# EAGLE schematic toro10 (EAGLE 7.7.0)

## Sheet 1 of 14: Power1
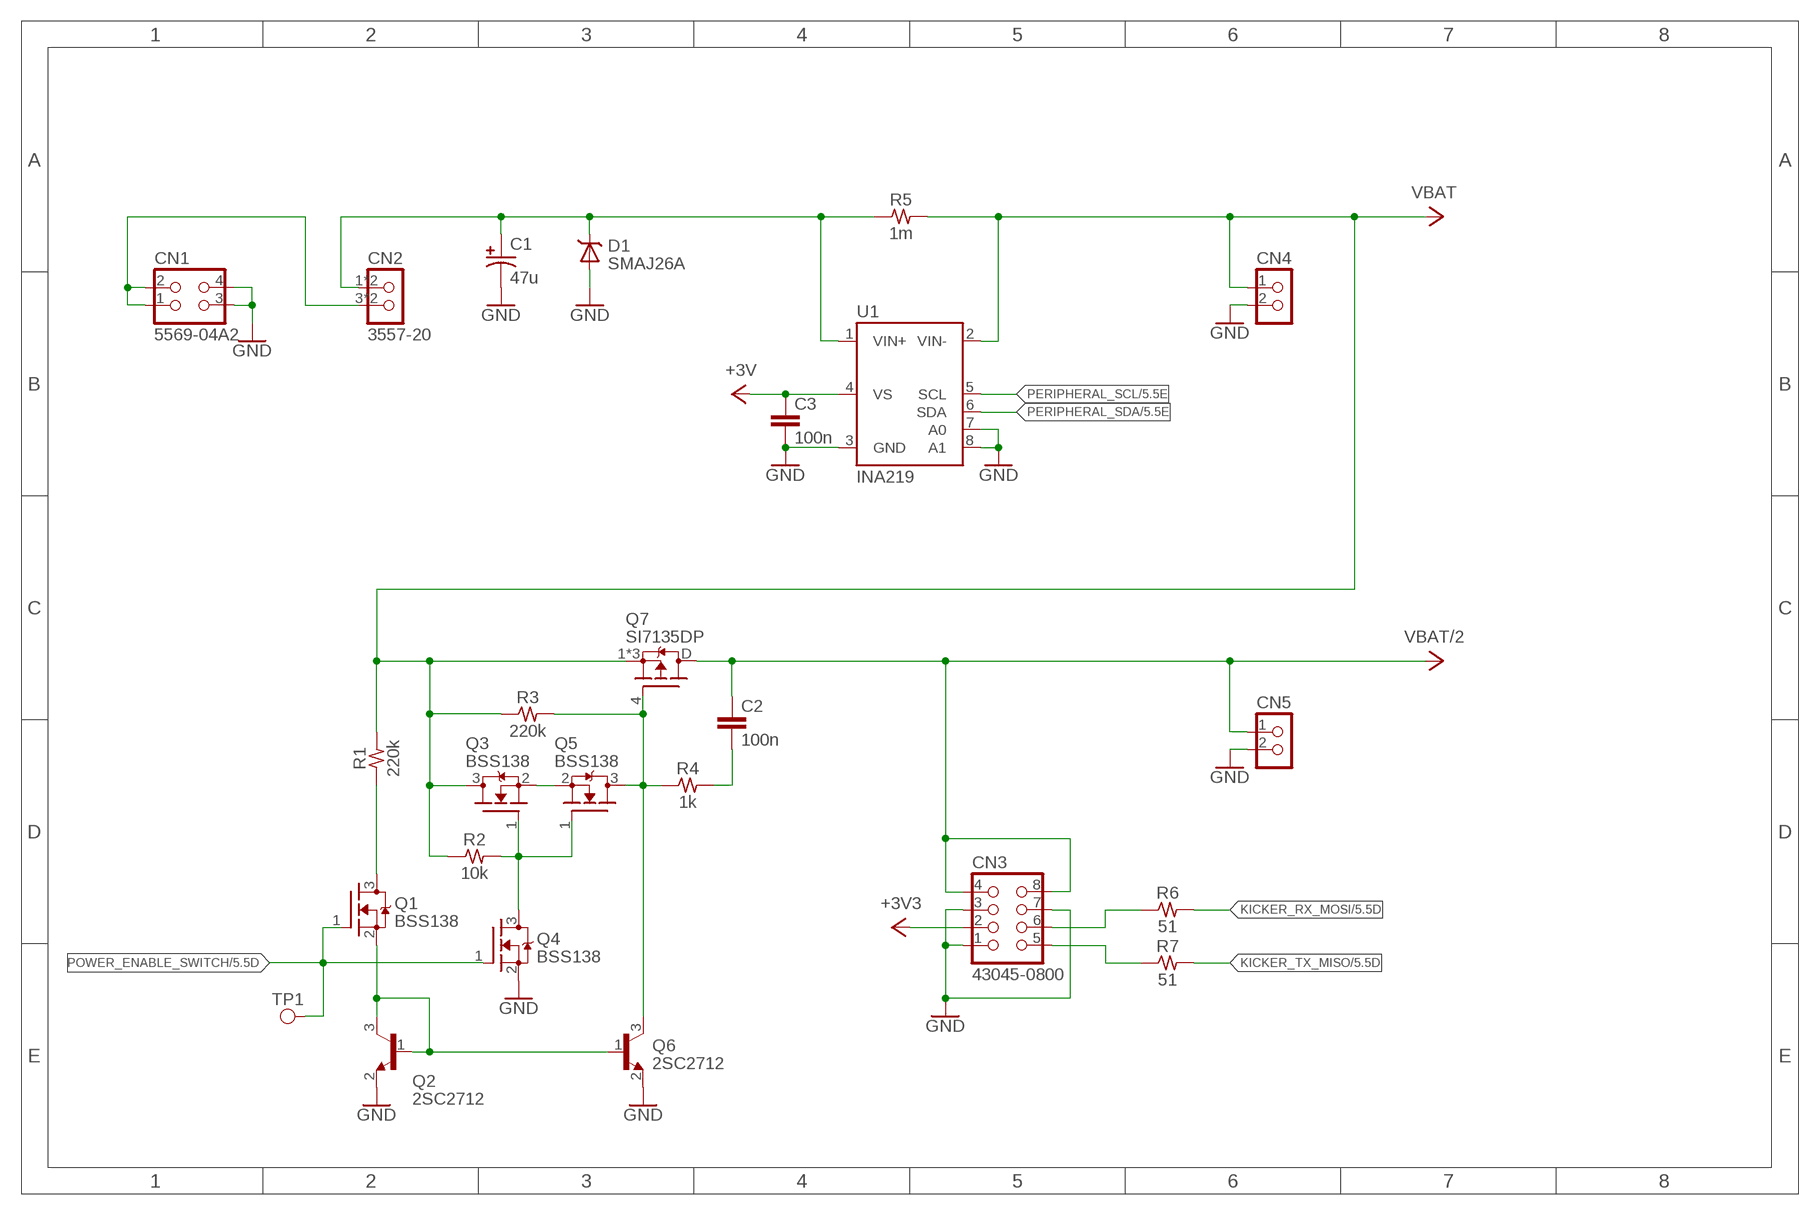
[diagram p0: schematic, sheet 1]

### Parts
C1  47u  CPOL2-5  [E2-5]
C2  100n  C1608  [1608]
C3  100n  C1608  [1608]
CN1  5569-04A2  [5569-04A2]
CN2  3557-20  [3557]
CN3  43045-0800  [43045-0800]
CN4  PIN1X2  [PIN1X2]
CN5  PIN1X2  [PIN1X2]
D1  SMAJ26A  ZENER-DO-214AC  [DO-214AC]
Q1  BSS138  MOS-N-SOT23  [SOT23-3]
Q2  2SC2712  NPN-SOT23  [SOT23-3]
Q3  BSS138  MOS-N-SOT23  [SOT23-3]
Q4  BSS138  MOS-N-SOT23  [SOT23-3]
Q5  BSS138  MOS-N-SOT23  [SOT23-3]
Q6  2SC2712  NPN-SOT23  [SOT23-3]
Q7  SI7135DP  MOS-P-POWERPAK-SO-8  [POWERPAK-SO-8-S]
R1  220k  R1608  [1608]
R2  10k  R1608  [1608]
R3  220k  R1608  [1608]
R4  1k  R1608  [1608]
R5  1m  WSLF2512  [WSLF2512]
R6  51  R1608  [1608]
R7  51  R1608  [1608]
TP1  TESTPAD-SMT  [TESTPAD-SMT]
U1  INA219  [SOT23-8]

### Nets
+3V: C3.1 U1.4(VS) ; also sheet 2,4,5,6,7,8,14
+3V3: CN3.2 ; also sheet 2,4
GND: C1.N C3.2 CN1.3 CN1.4 CN3.1 CN3.3 CN3.7 CN4.2 CN5.2 D1.A Q2.2(E) Q4.2(S) Q6.2(E) U1.3(GND) U1.7(A0) U1.8(A1) ; also sheet 2,3,4,5,6,7,8,9,10,11,12,13,14
KICKER_RX_MOSI: R6.2 ; also sheet 5
KICKER_TX_MISO: R7.2 ; also sheet 5
N$2: CN1.1 CN1.2 CN2.3 CN2.4
N$3: Q3.2(S) Q5.2(S)
N$5: Q3.1(G) Q4.3(D) Q5.1(G) R2.2
N$6: Q1.2(S) Q2.1(B) Q2.3(C) Q6.1(B)
N$9: Q5.3(D) Q6.3(C) Q7.4(G) R3.2 R4.1
N$10: C2.2 R4.2
N$11: Q1.3(D) R1.1
N$12: C1.P CN2.1 CN2.2 D1.K R5.1 U1.1(VIN+)
N$35: CN3.6 R6.1
N$36: CN3.5 R7.1
PERIPHERAL_SCL: U1.5(SCL) ; also sheet 5,6
PERIPHERAL_SDA: U1.6(SDA) ; also sheet 5,6
POWER_ENABLE_SWITCH: Q1.1(G) Q4.1(G) TP1.1 ; also sheet 5
VBAT: CN4.1 Q3.3(D) Q7.1(S) Q7.2(S) Q7.3(S) R1.2 R2.1 R3.1 R5.2 U1.2(VIN-) ; also sheet 2,4
VBAT/2: C2.1 CN3.4 CN3.8 CN5.1 Q7.D ; also sheet 3

## Sheet 2 of 14: Power2
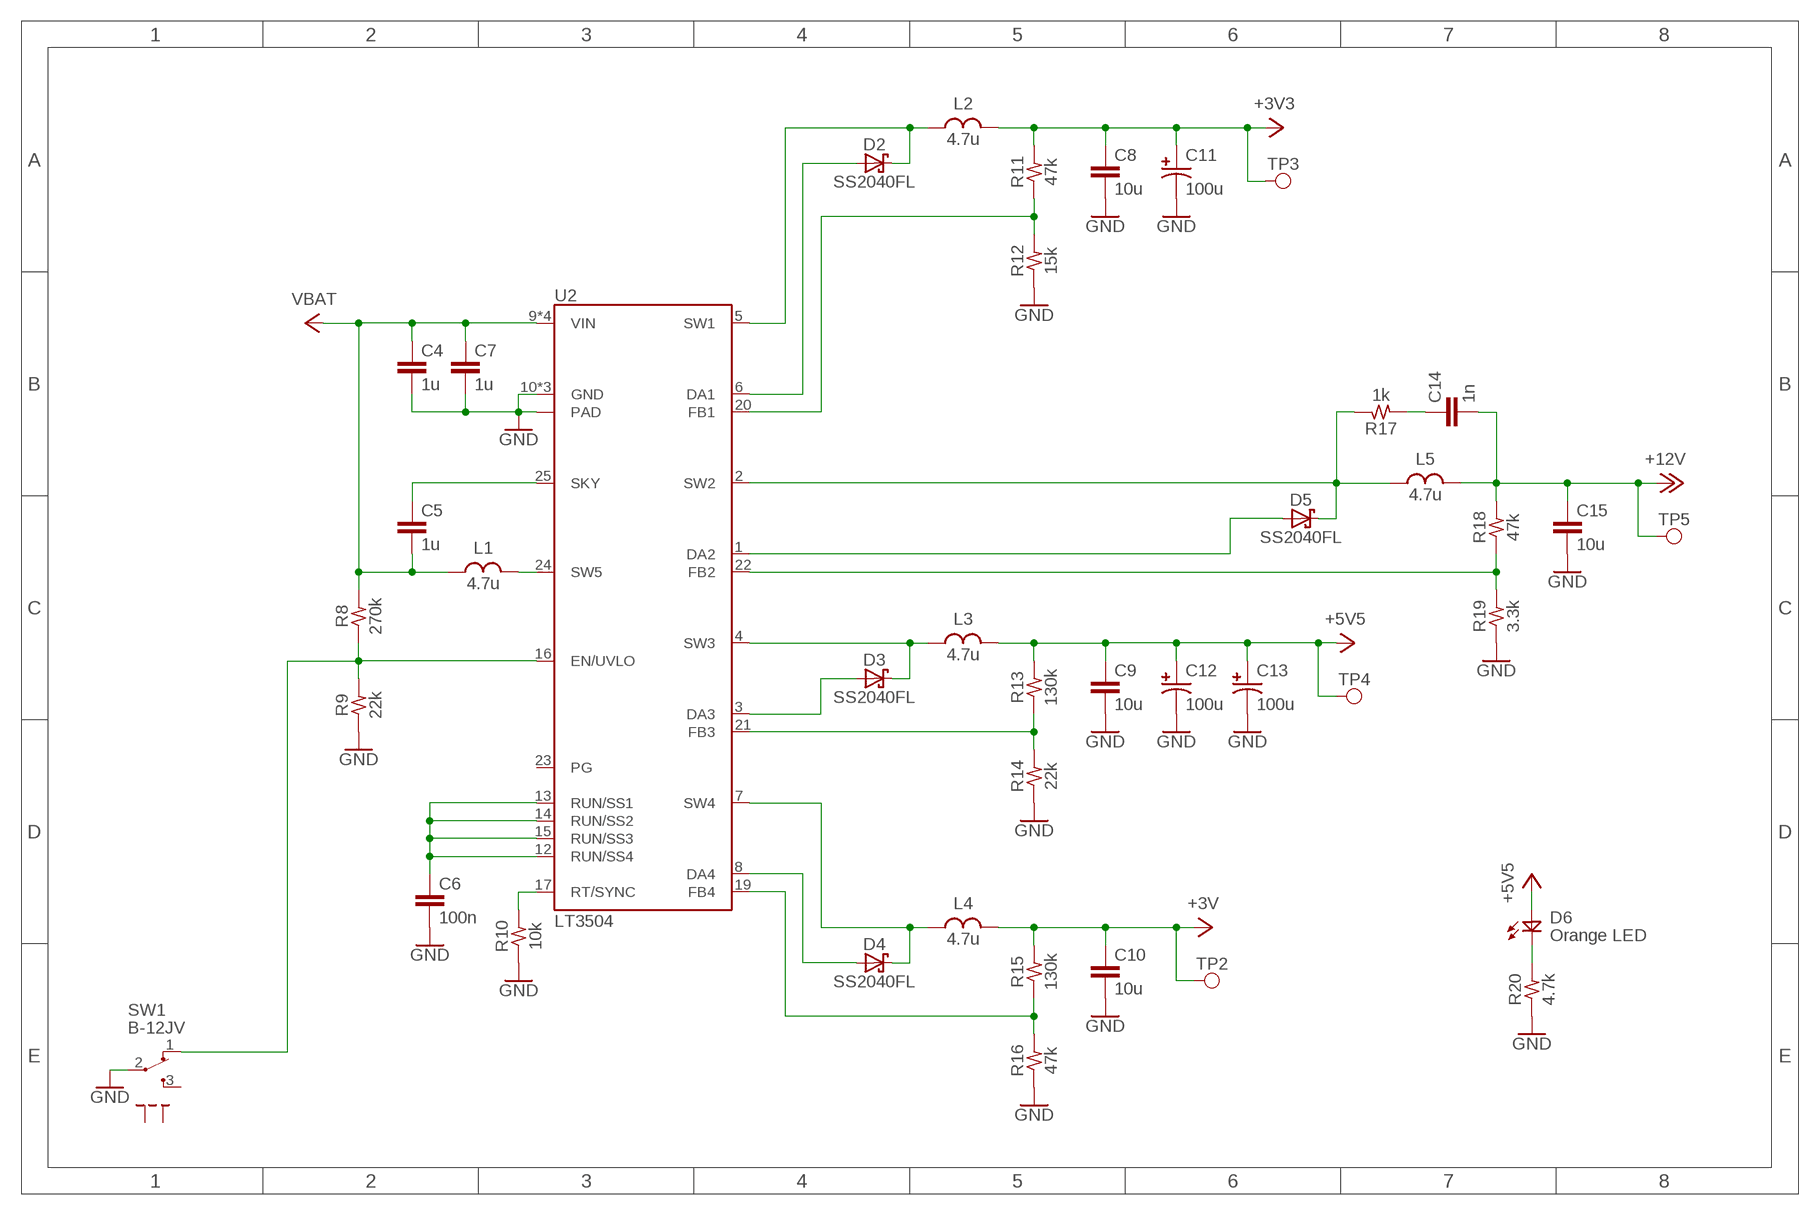
[diagram p1: schematic, sheet 2]

### Parts
C4  1u  C1608  [1608]
C5  1u  C1608  [1608]
C6  100n  C1608  [1608]
C7  1u  C1608  [1608]
C8  10u  C2012  [2012]
C9  10u  C2012  [2012]
C10  10u  C2012  [2012]
C11  100u  CPOL2-5  [E2-5]
C12  100u  CPOL2-5  [E2-5]
C13  100u  CPOL2-5  [E2-5]
C14  1n  C1608  [1608]
C15  10u  C2012  [2012]
D2  SS2040FL  SBD-SOD123  [SOD123]
D3  SS2040FL  SBD-SOD123  [SOD123]
D4  SS2040FL  SBD-SOD123  [SOD123]
D5  SS2040FL  SBD-SOD123  [SOD123]
D6  Orange LED  LED1608  [1608D]
L1  4.7u  L-TAIYO-MAMK2520  [MAMK2520]
L2  4.7u  L-TAIYO-MAMK2520  [MAMK2520]
L3  4.7u  L-TAIYO-MAMK2520  [MAMK2520]
L4  4.7u  L-TAIYO-MAMK2520  [MAMK2520]
L5  4.7u  L-TAIYO-MAMK2520  [MAMK2520]
R8  270k  R1608  [1608]
R9  22k  R1608  [1608]
R10  10k  R1608  [1608]
R11  47k  R1608  [1608]
R12  15k  R1608  [1608]
R13  130k  R1608  [1608]
R14  22k  R1608  [1608]
R15  130k  R1608  [1608]
R16  47k  R1608  [1608]
R17  1k  R1608  [1608]
R18  47k  R1608  [1608]
R19  3.3k  R1608  [1608]
R20  4.7k  R1608  [1608]
SW1  B-12JV  [B-12JV]
TP2  TESTPAD-TH  [TESTPAD-TH]
TP3  TESTPAD-TH  [TESTPAD-TH]
TP4  TESTPAD-TH  [TESTPAD-TH]
TP5  TESTPAD-TH  [TESTPAD-TH]
U2  LT3504  [QFN28-0.5]

### Nets
+3V: C10.1 L4.2 R15.2 TP2.1 ; also sheet 1,4,5,6,7,8,14
+3V3: C8.1 C11.P L2.2 R11.2 TP3.1 ; also sheet 1,4
+5V5: C9.1 C12.P C13.P D6.A L3.2 R13.2 TP4.1 ; also sheet 4,7,9,10,11,12,13
+12V: C14.2 C15.1 L5.2 R18.2 TP5.1 ; also sheet 3,9,10,11,12,13
GND: C4.2 C6.2 C7.2 C8.2 C9.2 C10.2 C11.N C12.N C13.N C15.2 R9.1 R10.1 R12.1 R14.1 R16.1 R19.1 R20.1 SW1.2(COM) U2.10(GND) U2.18(GND) U2.27(GND) U2.PAD ; also sheet 1,3,4,5,6,7,8,9,10,11,12,13,14
N$1: R18.1 R19.2 U2.22(FB2)
N$4: L1.2 U2.24(SW5)
N$7: C6.1 U2.12(RUN/SS4) U2.13(RUN/SS1) U2.14(RUN/SS2) U2.15(RUN/SS3)
N$8: R10.2 U2.17(RT/SYNC)
N$13: C5.1 U2.25(SKY)
N$14: D2.K L2.1 U2.5(SW1)
N$15: D5.K L5.1 R17.1 U2.2(SW2)
N$16: R8.1 R9.2 SW1.1(A) U2.16(EN/UVLO)
N$17: R15.1 R16.2 U2.19(FB4)
N$18: R11.1 R12.2 U2.20(FB1)
N$20: D5.A U2.1(DA2)
N$21: R13.1 R14.2 U2.21(FB3)
N$22: D3.A U2.3(DA3)
N$23: D3.K L3.1 U2.4(SW3)
N$24: D4.K L4.1 U2.7(SW4)
N$25: D4.A U2.8(DA4)
N$26: C14.1 R17.2
N$44: D2.A U2.6(DA1)
N$175: D6.K R20.2
VBAT: C4.1 C5.2 C7.1 L1.1 R8.2 U2.9(VIN) U2.11(VIN) U2.26(VIN) U2.28(VIN) ; also sheet 1,4
Unconnected: SW1.3(B) SW1.S1 SW1.S2 U2.23(PG)

## Sheet 3 of 14: Power3
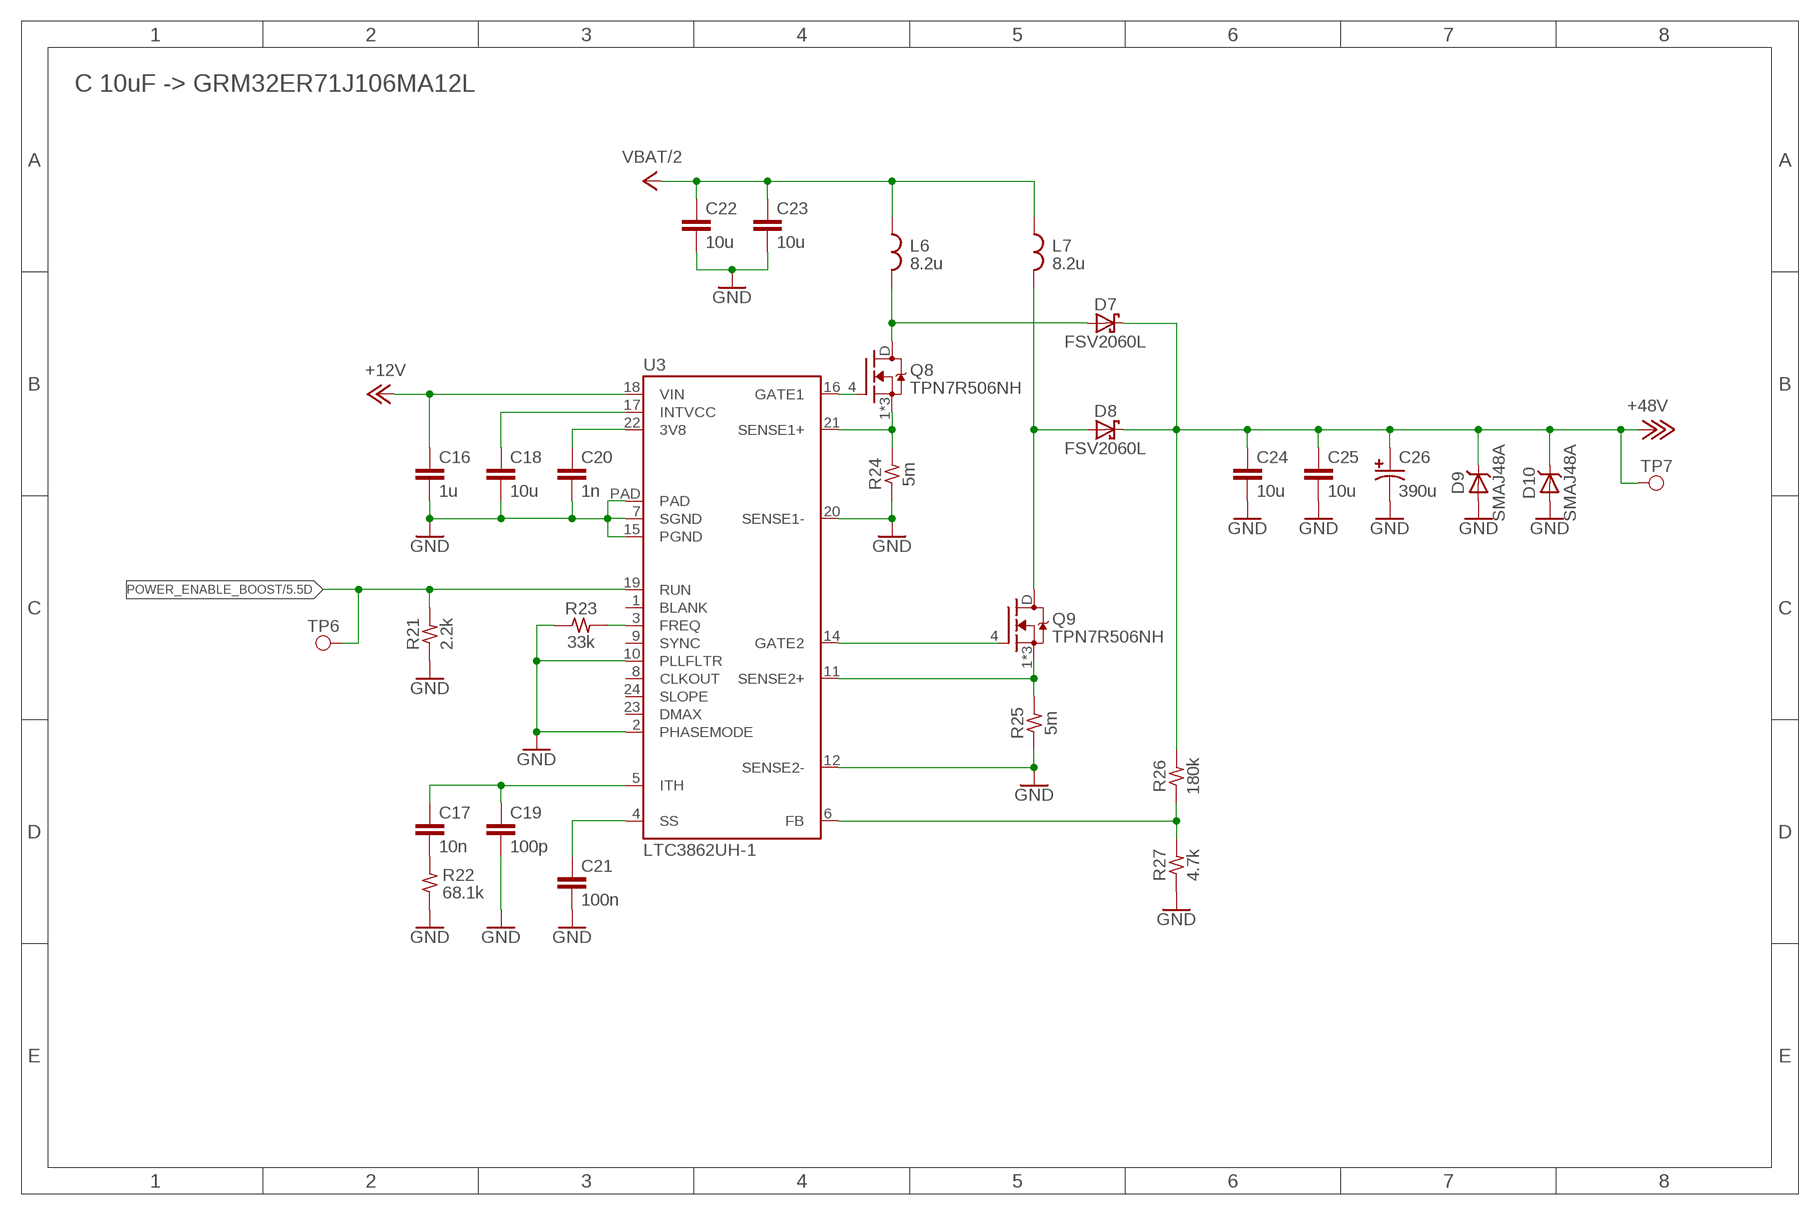
[diagram p2: schematic, sheet 3]

### Parts
C16  1u  C1608  [1608]
C17  10n  C1608  [1608]
C18  10u  C2012  [2012]
C19  100p  C1608  [1608]
C20  1n  C1608  [1608]
C21  100n  C1608  [1608]
C22  10u  C3225  [3225]
C23  10u  C3225  [3225]
C24  10u  C3225  [3225]
C25  10u  C3225  [3225]
C26  390u  CPOL7.5-18  [E7.5-18]
D7  FSV2060L  SBD-TO-277-3  [TO-277-3]
D8  FSV2060L  SBD-TO-277-3  [TO-277-3]
D9  SMAJ48A  ZENER-DO-214AC  [DO-214AC]
D10  SMAJ48A  ZENER-DO-214AC  [DO-214AC]
L6  8.2u  L-VISHAY-ER  [L-VISHAY-ER]
L7  8.2u  L-VISHAY-ER  [L-VISHAY-ER]
Q8  TPN7R506NH  MOS-N-TSON-8_3.3  [TSON-8_3.3]
Q9  TPN7R506NH  MOS-N-TSON-8_3.3  [TSON-8_3.3]
R21  2.2k  R1608  [1608]
R22  68.1k  R1608  [1608]
R23  33k  R1608  [1608]
R24  5m  R3216WL  [3216WL]
R25  5m  R3216WL  [3216WL]
R26  180k  R1608  [1608]
R27  4.7k  R1608  [1608]
TP6  TESTPAD-SMT  [TESTPAD-SMT]
TP7  TESTPAD-SMT  [TESTPAD-SMT]
U3  LTC3862UH-1  [QFN24-0.65]

### Nets
+12V: C16.1 U3.18(VIN) ; also sheet 2,9,10,11,12,13
+48V: C24.1 C25.1 C26.P D7.3(K) D8.3(K) D9.K D10.K R26.2 TP7.1 ; also sheet 9,10,11,12,13
GND: C16.2 C18.2 C19.2 C20.2 C21.2 C22.2 C23.2 C24.2 C25.2 C26.N D9.A D10.A R21.1 R22.1 R23.1 R24.1 R25.1 R27.1 U3.2(PHASEMODE) U3.7(SGND) U3.10(PLLFLTR) U3.12(SENSE2-) U3.15(PGND) U3.20(SENSE1-) U3.PAD ; also sheet 1,2,4,5,6,7,8,9,10,11,12,13,14
N$19: Q8.1(S) Q8.2(S) Q8.3(S) R24.2 U3.21(SENSE1+)
N$27: C18.1 U3.17(INTVCC)
N$29: Q8.4(G) U3.16(GATE1)
N$30: D7.1(A) D7.2(A) L6.2 Q8.D
N$31: Q9.1(S) Q9.2(S) Q9.3(S) R25.2 U3.11(SENSE2+)
N$32: C20.1 U3.22(3V8)
N$33: Q9.4(G) U3.14(GATE2)
N$34: D8.1(A) D8.2(A) L7.2 Q9.D
N$37: R26.1 R27.2 U3.6(FB)
N$39: C21.1 U3.4(SS)
N$40: C17.2 R22.2
N$41: C17.1 C19.1 U3.5(ITH)
N$42: R23.2 U3.3(FREQ)
POWER_ENABLE_BOOST: R21.2 TP6.1 U3.19(RUN) ; also sheet 5
VBAT/2: C22.1 C23.1 L6.1 L7.1 ; also sheet 1
Unconnected: U3.1(BLANK) U3.8(CLKOUT) U3.9(SYNC) U3.23(DMAX) U3.24(SLOPE)

### Notes on the sheet
- C 10uF -> GRM32ER71J106MA12L

## Sheet 4 of 14: Interface
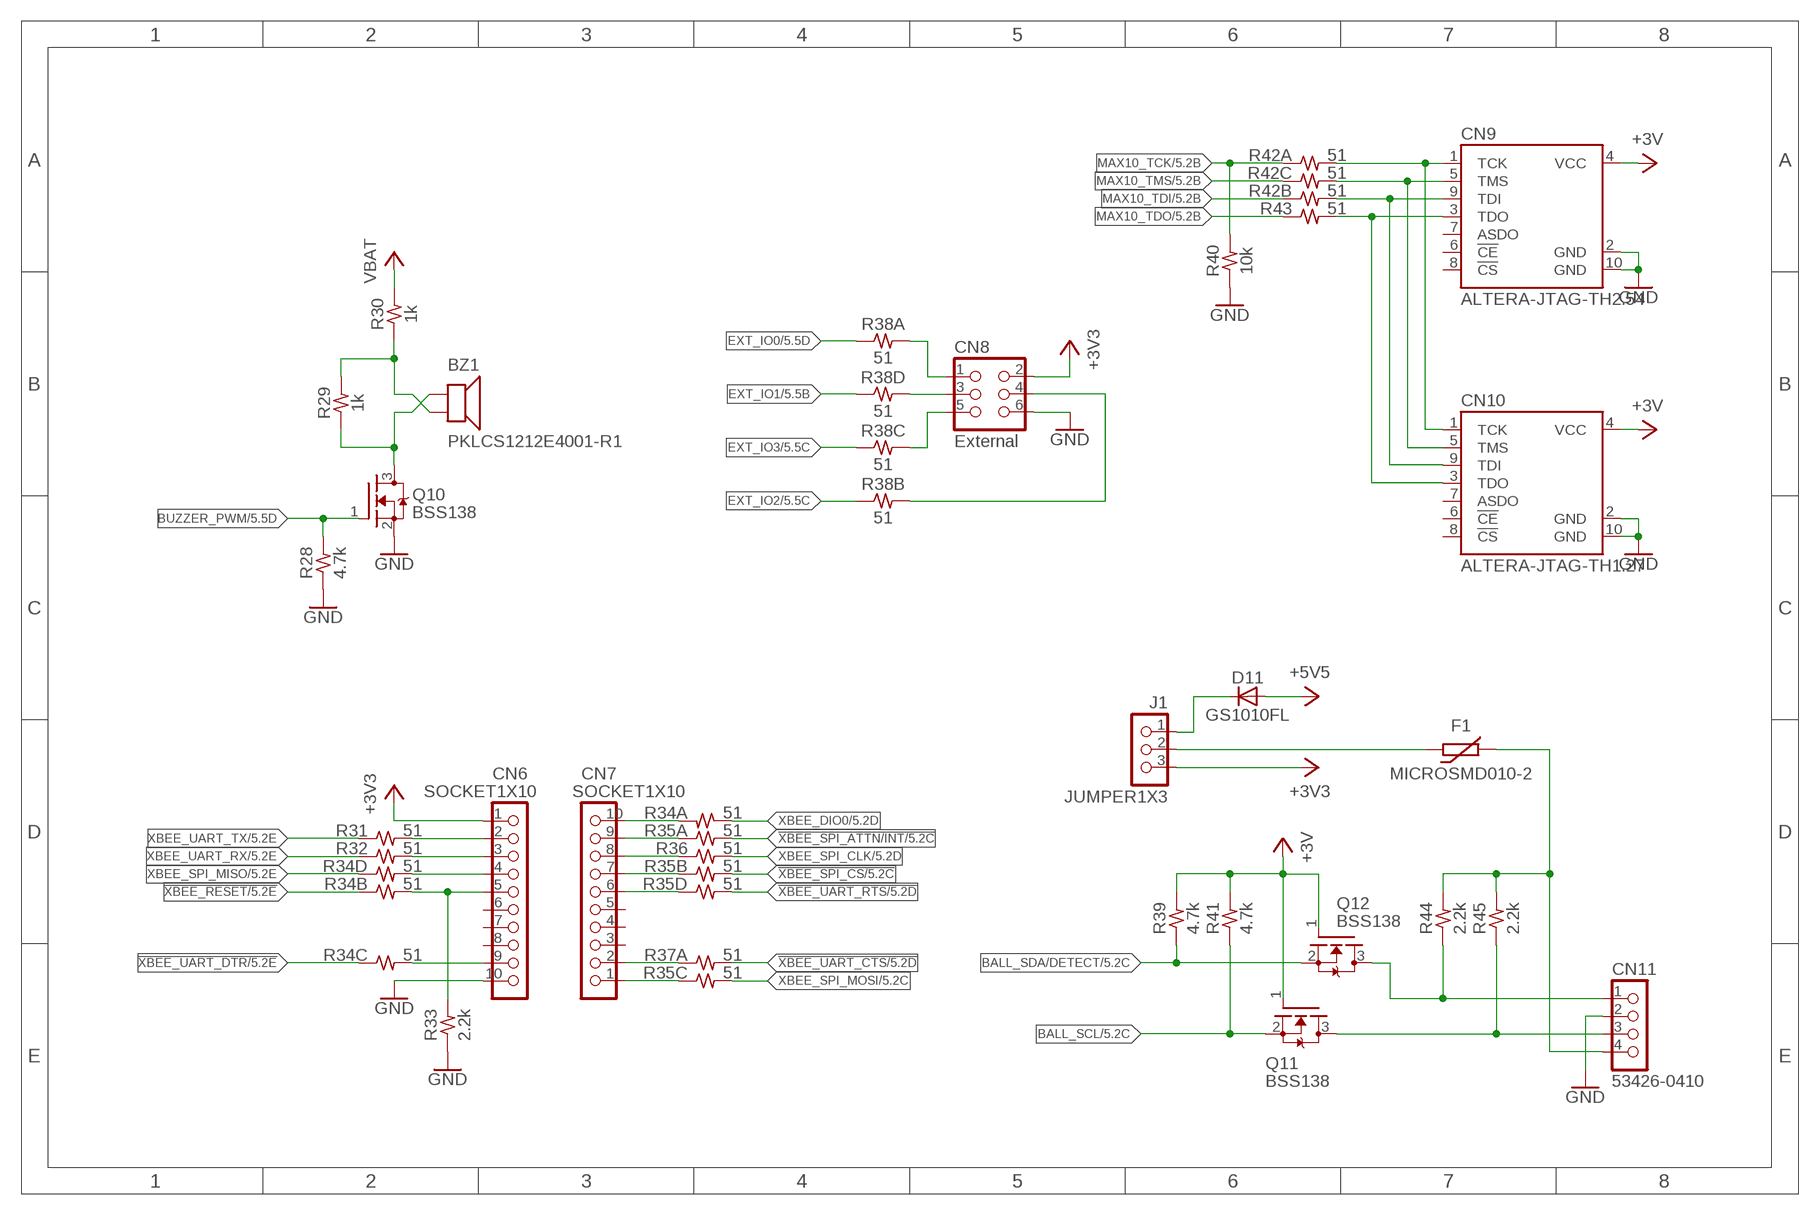
[diagram p3: schematic, sheet 4]

### Parts
BZ1  PKLCS1212E4001-R1  PKLCS1212E4001  [PKLCS1212]
CN6  SOCKET1X10  SOCKET1X10-TH2.0  [SOCKET1X10-TH2.0]
CN7  SOCKET1X10  SOCKET1X10-TH2.0  [SOCKET1X10-TH2.0]
CN8  External  PIN2X3  [PIN2X3]
CN9  ALTERA-JTAG-TH2.54  [PIN2X5]
CN10  ALTERA-JTAG-TH1.27  [PIN2X5-1.27]
CN11  53426-0410  [53426-04]
D11  GS1010FL  DIODE-SOD123  [SOD123]
F1  MICROSMD010-2  RF3225  [3225]
J1  JUMPER1X3  [PIN1X3]
Q10  BSS138  MOS-N-SOT23  [SOT23-3]
Q11  BSS138  MOS-N-SOT23  [SOT23-3]
Q12  BSS138  MOS-N-SOT23  [SOT23-3]
R28  4.7k  R1608  [1608]
R29  1k  R1608  [1608]
R30  1k  R1608  [1608]
R31  51  R1608  [1608]
R32  51  R1608  [1608]
R33  2.2k  R1608  [1608]
R34  51  R4A1608  [1608-4A]
R35  51  R4A1608  [1608-4A]
R36  51  R1608  [1608]
R37  51  R4A1608  [1608-4A]
R38  51  R4A1608  [1608-4A]
R39  4.7k  R1608  [1608]
R40  10k  R1608  [1608]
R41  4.7k  R1608  [1608]
R42  51  R4A1608  [1608-4A]
R43  51  R1608  [1608]
R44  2.2k  R1608  [1608]
R45  2.2k  R1608  [1608]

### Nets
!XBEE_RESET: R34.B1 ; also sheet 5
!XBEE_SPI_ATTN/INT: R35.A2 ; also sheet 5
!XBEE_SPI_CS: R35.B2 ; also sheet 5
!XBEE_UART_CTS: R37.A2 ; also sheet 5
!XBEE_UART_DTR: R34.C1 ; also sheet 5
!XBEE_UART_RTS: R35.D2 ; also sheet 5
+3V: CN9.4(VCC) CN10.4(VCC) Q11.1(G) Q12.1(G) R39.2 R41.2 ; also sheet 1,2,5,6,7,8,14
+3V3: CN6.1 CN8.2 J1.3 ; also sheet 1,2
+5V5: D11.A ; also sheet 2,7,9,10,11,12,13
BALL_SCL: Q11.2(S) R41.1 ; also sheet 5
BALL_SDA/DETECT: Q12.2(S) R39.1 ; also sheet 5
BUZZER_PWM: Q10.1(G) R28.2 ; also sheet 5
EXT_IO0: R38.A1 ; also sheet 5
EXT_IO1: R38.D1 ; also sheet 5
EXT_IO2: R38.B1 ; also sheet 5
EXT_IO3: R38.C1 ; also sheet 5
GND: CN6.10 CN8.6 CN9.2(GND) CN9.10(GND) CN10.2(GND) CN10.10(GND) CN11.2 Q10.2(S) R28.1 R33.1 R40.1 ; also sheet 1,2,3,5,6,7,8,9,10,11,12,13,14
MAX10_TCK: R40.2 R42.A1 ; also sheet 5
MAX10_TDI: R42.B1 ; also sheet 5
MAX10_TDO: R43.1 ; also sheet 5
MAX10_TMS: R42.C1 ; also sheet 5
N$28: CN9.5(TMS) CN10.5(TMS) R42.C2
N$38: CN9.9(TDI) CN10.9(TDI) R42.B2
N$43: CN9.1(TCK) CN10.1(TCK) R42.A2
N$138: BZ1.1 Q10.3(D) R29.1
N$139: CN9.3(TDO) CN10.3(TDO) R43.2
N$141: CN8.1 R38.A2
N$142: BZ1.2 R29.2 R30.1
N$143: CN8.3 R38.D2
N$144: CN8.5 R38.C2
N$145: CN8.4 R38.B2
N$150: CN11.4 F1.2 R44.2 R45.2
N$152: D11.K J1.1
N$155: F1.1 J1.2
N$171: CN11.3 Q11.3(D) R45.1
N$172: CN11.1 Q12.3(D) R44.1
N$180: CN7.2 R37.A1
N$181: CN7.9 R35.A1
N$182: CN7.7 R35.B1
N$183: CN7.6 R35.D1
N$184: CN7.1 R35.C1
N$185: CN7.10 R34.A2
N$186: CN6.4 R34.D2
N$187: CN6.5 R33.2 R34.B2
N$188: CN6.9 R34.C2
N$189: CN7.8 R36.1
N$190: CN6.2 R31.2
N$191: CN6.3 R32.2
VBAT: R30.2 ; also sheet 1,2
XBEE_DIO0: R34.A1 ; also sheet 5
XBEE_SPI_CLK: R36.2 ; also sheet 5
XBEE_SPI_MISO: R34.D1 ; also sheet 5
XBEE_SPI_MOSI: R35.C2 ; also sheet 5
XBEE_UART_RX: R32.1 ; also sheet 5
XBEE_UART_TX: R31.1 ; also sheet 5
Unconnected: CN6.6 CN6.7 CN6.8 CN7.3 CN7.4 CN7.5 CN9.6(!CE) CN9.7(ASDO) CN9.8(!CS) CN10.6(!CE) CN10.7(ASDO) CN10.8(!CS) R42.D1 R42.D2

## Sheet 5 of 14: FPGA
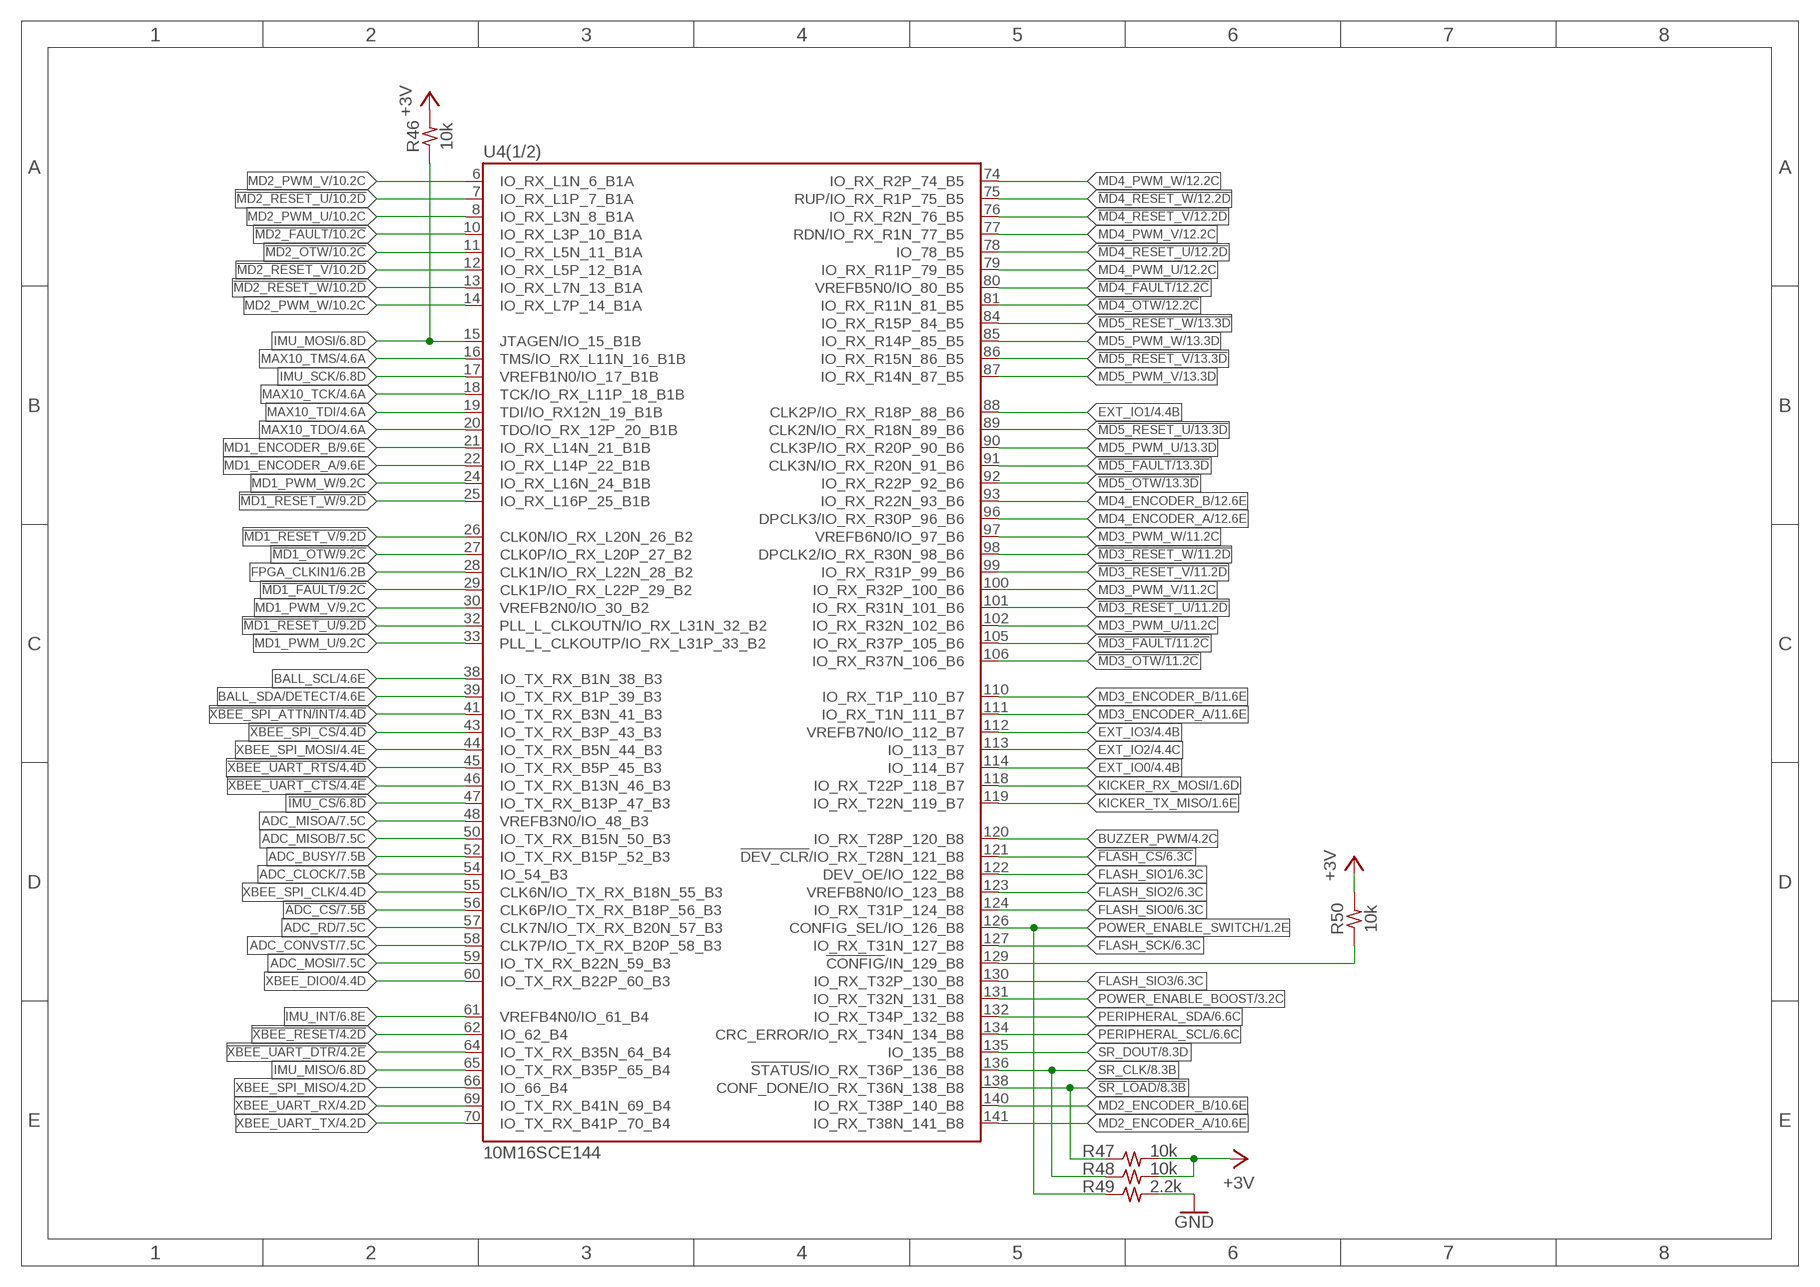
[diagram p4: schematic, sheet 5]

### Parts
R46  10k  R1608  [1608]
R47  10k  R1608  [1608]
R48  10k  R1608  [1608]
R49  2.2k  R1608  [1608]
R50  10k  R1608  [1608]
U4  10M16SCE144  [QFP144-0.5-PAD]

### Nets
!ADC_CS: U4.56((1/2):CLK6P/IO_TX_RX_B18P_56_B3) ; also sheet 7
!FLASH_CS: U4.121((1/2):!DEV_CLR!/IO_RX_T28N_121_B8) ; also sheet 6
!IMU_CS: U4.47((1/2):IO_TX_RX_B13P_47_B3) ; also sheet 6
!MAX10_CONFIG: R50.1 U4.129((1/2):!CONFIG!/IN_129_B8)
!MD1_FAULT: U4.29((1/2):CLK1P/IO_RX_L22P_29_B2) ; also sheet 9
!MD1_OTW: U4.27((1/2):CLK0P/IO_RX_L20P_27_B2) ; also sheet 9
!MD1_RESET_U: U4.32((1/2):PLL_L_CLKOUTN/IO_RX_L31N_32_B2) ; also sheet 9
!MD1_RESET_V: U4.26((1/2):CLK0N/IO_RX_L20N_26_B2) ; also sheet 9
!MD1_RESET_W: U4.25((1/2):IO_RX_L16P_25_B1B) ; also sheet 9
!MD2_FAULT: U4.10((1/2):IO_RX_L3P_10_B1A) ; also sheet 10
!MD2_OTW: U4.11((1/2):IO_RX_L5N_11_B1A) ; also sheet 10
!MD2_RESET_U: U4.7((1/2):IO_RX_L1P_7_B1A) ; also sheet 10
!MD2_RESET_V: U4.12((1/2):IO_RX_L5P_12_B1A) ; also sheet 10
!MD2_RESET_W: U4.13((1/2):IO_RX_L7N_13_B1A) ; also sheet 10
!MD3_FAULT: U4.105((1/2):IO_RX_R37P_105_B6) ; also sheet 11
!MD3_OTW: U4.106((1/2):IO_RX_R37N_106_B6) ; also sheet 11
!MD3_RESET_U: U4.101((1/2):IO_RX_R31N_101_B6) ; also sheet 11
!MD3_RESET_V: U4.99((1/2):IO_RX_R31P_99_B6) ; also sheet 11
!MD3_RESET_W: U4.98((1/2):DPCLK2/IO_RX_R30N_98_B6) ; also sheet 11
!MD4_FAULT: U4.80((1/2):VREFB5N0/IO_80_B5) ; also sheet 12
!MD4_OTW: U4.81((1/2):IO_RX_R11N_81_B5) ; also sheet 12
!MD4_RESET_U: U4.78((1/2):IO_78_B5) ; also sheet 12
!MD4_RESET_V: U4.76((1/2):IO_RX_R2N_76_B5) ; also sheet 12
!MD4_RESET_W: U4.75((1/2):RUP/IO_RX_R1P_75_B5) ; also sheet 12
!MD5_FAULT: U4.91((1/2):CLK3N/IO_RX_R20N_91_B6) ; also sheet 13
!MD5_OTW: U4.92((1/2):IO_RX_R22P_92_B6) ; also sheet 13
!MD5_RESET_U: U4.89((1/2):CLK2N/IO_RX_R18N_89_B6) ; also sheet 13
!MD5_RESET_V: U4.86((1/2):IO_RX_R15N_86_B5) ; also sheet 13
!MD5_RESET_W: U4.84((1/2):IO_RX_R15P_84_B5) ; also sheet 13
!SR_LOAD: R47.1 U4.138((1/2):CONF_DONE/IO_RX_T36N_138_B8) ; also sheet 8
!XBEE_RESET: U4.62((1/2):IO_62_B4) ; also sheet 4
!XBEE_SPI_ATTN/INT: U4.41((1/2):IO_TX_RX_B3N_41_B3) ; also sheet 4
!XBEE_SPI_CS: U4.43((1/2):IO_TX_RX_B3P_43_B3) ; also sheet 4
!XBEE_UART_CTS: U4.46((1/2):IO_TX_RX_B13N_46_B3) ; also sheet 4
!XBEE_UART_DTR: U4.64((1/2):IO_TX_RX_B35N_64_B4) ; also sheet 4
!XBEE_UART_RTS: U4.45((1/2):IO_TX_RX_B5P_45_B3) ; also sheet 4
+3V: R46.2 R47.2 R48.2 R50.2 ; also sheet 1,2,4,6,7,8,14
ADC_BUSY: U4.52((1/2):IO_TX_RX_B15P_52_B3) ; also sheet 7
ADC_CLOCK: U4.54((1/2):IO_54_B3) ; also sheet 7
ADC_CONVST: U4.58((1/2):CLK7P/IO_TX_RX_B20P_58_B3) ; also sheet 7
ADC_MISOA: U4.48((1/2):VREFB3N0/IO_48_B3) ; also sheet 7
ADC_MISOB: U4.50((1/2):IO_TX_RX_B15N_50_B3) ; also sheet 7
ADC_MOSI: U4.59((1/2):IO_TX_RX_B22N_59_B3) ; also sheet 7
ADC_RD: U4.57((1/2):CLK7N/IO_TX_RX_B20N_57_B3) ; also sheet 7
BALL_SCL: U4.38((1/2):IO_TX_RX_B1N_38_B3) ; also sheet 4
BALL_SDA/DETECT: U4.39((1/2):IO_TX_RX_B1P_39_B3) ; also sheet 4
BUZZER_PWM: U4.120((1/2):IO_RX_T28P_120_B8) ; also sheet 4
EXT_IO0: U4.114((1/2):IO_114_B7) ; also sheet 4
EXT_IO1: U4.88((1/2):CLK2P/IO_RX_R18P_88_B6) ; also sheet 4
EXT_IO2: U4.113((1/2):IO_113_B7) ; also sheet 4
EXT_IO3: U4.112((1/2):VREFB7N0/IO_112_B7) ; also sheet 4
FLASH_SCK: U4.127((1/2):IO_RX_T31N_127_B8) ; also sheet 6
FLASH_SIO0: U4.124((1/2):IO_RX_T31P_124_B8) ; also sheet 6
FLASH_SIO1: U4.122((1/2):DEV_OE/IO_122_B8) ; also sheet 6
FLASH_SIO2: U4.123((1/2):VREFB8N0/IO_123_B8) ; also sheet 6
FLASH_SIO3: U4.130((1/2):IO_RX_T32P_130_B8) ; also sheet 6
FPGA_CLKIN1: U4.28((1/2):CLK1N/IO_RX_L22N_28_B2) ; also sheet 6
GND: R49.2 ; also sheet 1,2,3,4,6,7,8,9,10,11,12,13,14
IMU_INT: U4.61((1/2):VREFB4N0/IO_61_B4) ; also sheet 6
IMU_MISO: U4.65((1/2):IO_TX_RX_B35P_65_B4) ; also sheet 6
IMU_MOSI: R46.1 U4.15((1/2):JTAGEN/IO_15_B1B) ; also sheet 6
IMU_SCK: U4.17((1/2):VREFB1N0/IO_17_B1B) ; also sheet 6
KICKER_RX_MOSI: U4.118((1/2):IO_RX_T22P_118_B7) ; also sheet 1
KICKER_TX_MISO: U4.119((1/2):IO_RX_T22N_119_B7) ; also sheet 1
MAX10_TCK: U4.18((1/2):TCK/IO_RX_L11P_18_B1B) ; also sheet 4
MAX10_TDI: U4.19((1/2):TDI/IO_RX12N_19_B1B) ; also sheet 4
MAX10_TDO: U4.20((1/2):TDO/IO_RX_12P_20_B1B) ; also sheet 4
MAX10_TMS: U4.16((1/2):TMS/IO_RX_L11N_16_B1B) ; also sheet 4
MD1_ENCODER_A: U4.22((1/2):IO_RX_L14P_22_B1B) ; also sheet 9
MD1_ENCODER_B: U4.21((1/2):IO_RX_L14N_21_B1B) ; also sheet 9
MD1_PWM_U: U4.33((1/2):PLL_L_CLKOUTP/IO_RX_L31P_33_B2) ; also sheet 9
MD1_PWM_V: U4.30((1/2):VREFB2N0/IO_30_B2) ; also sheet 9
MD1_PWM_W: U4.24((1/2):IO_RX_L16N_24_B1B) ; also sheet 9
MD2_ENCODER_A: U4.141((1/2):IO_RX_T38N_141_B8) ; also sheet 10
MD2_ENCODER_B: U4.140((1/2):IO_RX_T38P_140_B8) ; also sheet 10
MD2_PWM_U: U4.8((1/2):IO_RX_L3N_8_B1A) ; also sheet 10
MD2_PWM_V: U4.6((1/2):IO_RX_L1N_6_B1A) ; also sheet 10
MD2_PWM_W: U4.14((1/2):IO_RX_L7P_14_B1A) ; also sheet 10
MD3_ENCODER_A: U4.111((1/2):IO_RX_T1N_111_B7) ; also sheet 11
MD3_ENCODER_B: U4.110((1/2):IO_RX_T1P_110_B7) ; also sheet 11
MD3_PWM_U: U4.102((1/2):IO_RX_R32N_102_B6) ; also sheet 11
MD3_PWM_V: U4.100((1/2):IO_RX_R32P_100_B6) ; also sheet 11
MD3_PWM_W: U4.97((1/2):VREFB6N0/IO_97_B6) ; also sheet 11
MD4_ENCODER_A: U4.96((1/2):DPCLK3/IO_RX_R30P_96_B6) ; also sheet 12
MD4_ENCODER_B: U4.93((1/2):IO_RX_R22N_93_B6) ; also sheet 12
MD4_PWM_U: U4.79((1/2):IO_RX_R11P_79_B5) ; also sheet 12
MD4_PWM_V: U4.77((1/2):RDN/IO_RX_R1N_77_B5) ; also sheet 12
MD4_PWM_W: U4.74((1/2):IO_RX_R2P_74_B5) ; also sheet 12
MD5_PWM_U: U4.90((1/2):CLK3P/IO_RX_R20P_90_B6) ; also sheet 13
MD5_PWM_V: U4.87((1/2):IO_RX_R14N_87_B5) ; also sheet 13
MD5_PWM_W: U4.85((1/2):IO_RX_R14P_85_B5) ; also sheet 13
PERIPHERAL_SCL: U4.134((1/2):CRC_ERROR/IO_RX_T34N_134_B8) ; also sheet 1,6
PERIPHERAL_SDA: U4.132((1/2):IO_RX_T34P_132_B8) ; also sheet 1,6
POWER_ENABLE_BOOST: U4.131((1/2):IO_RX_T32N_131_B8) ; also sheet 3
POWER_ENABLE_SWITCH: R49.1 U4.126((1/2):CONFIG_SEL/IO_126_B8) ; also sheet 1
SR_CLK: R48.1 U4.136((1/2):!STATUS!/IO_RX_T36P_136_B8) ; also sheet 8
SR_DOUT: U4.135((1/2):IO_135_B8) ; also sheet 8
XBEE_DIO0: U4.60((1/2):IO_TX_RX_B22P_60_B3) ; also sheet 4
XBEE_SPI_CLK: U4.55((1/2):CLK6N/IO_TX_RX_B18N_55_B3) ; also sheet 4
XBEE_SPI_MISO: U4.66((1/2):IO_66_B4) ; also sheet 4
XBEE_SPI_MOSI: U4.44((1/2):IO_TX_RX_B5N_44_B3) ; also sheet 4
XBEE_UART_RX: U4.69((1/2):IO_TX_RX_B41N_69_B4) ; also sheet 4
XBEE_UART_TX: U4.70((1/2):IO_TX_RX_B41P_70_B4) ; also sheet 4

## Sheet 6 of 14: Peripheral
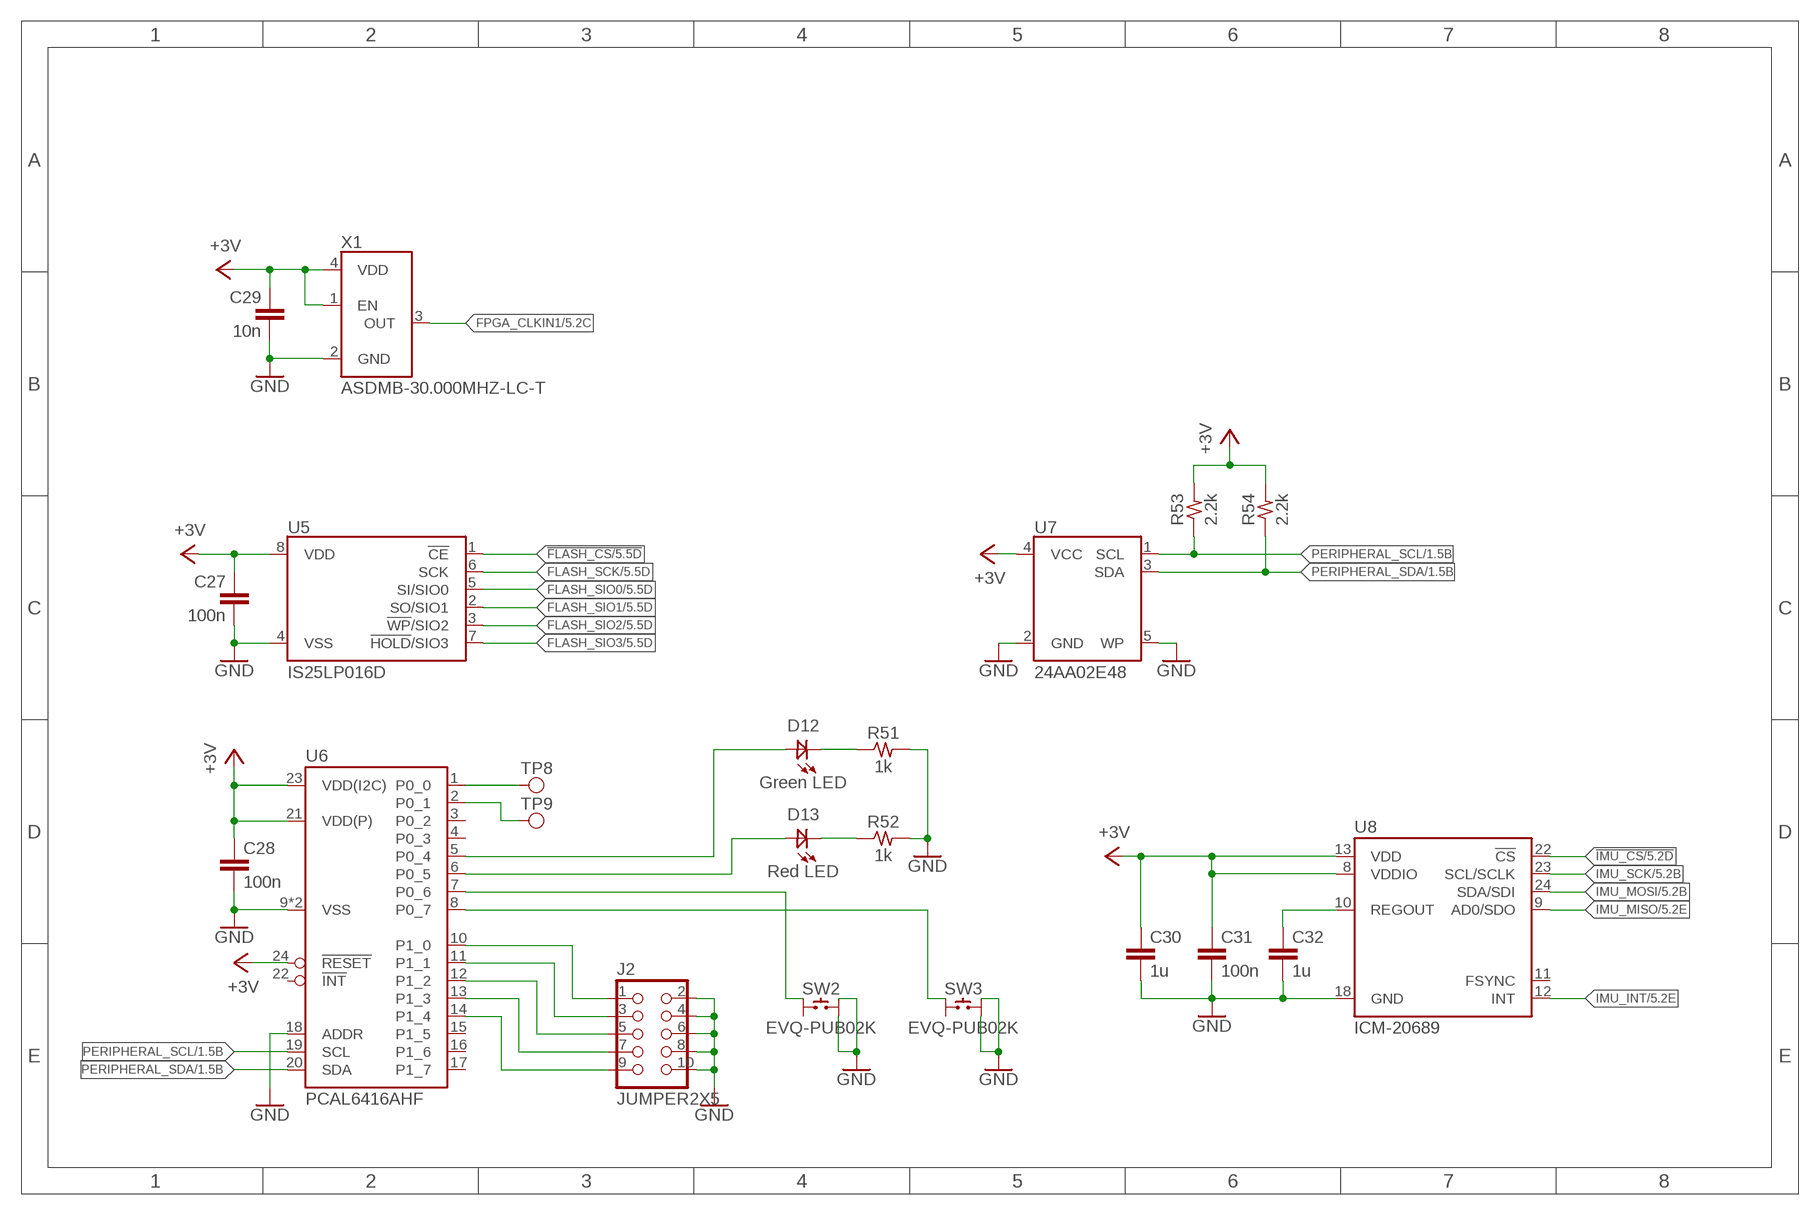
[diagram p5: schematic, sheet 6]

### Parts
C27  100n  C1608  [1608]
C28  100n  C1608  [1608]
C29  10n  C1608  [1608]
C30  1u  C1608  [1608]
C31  100n  C1608  [1608]
C32  1u  C1608  [1608]
D12  Green LED  LED1608  [1608D]
D13  Red LED  LED1608  [1608D]
J2  JUMPER2X5  [PIN2X5]
R51  1k  R1608  [1608]
R52  1k  R1608  [1608]
R53  2.2k  R1608  [1608]
R54  2.2k  R1608  [1608]
SW2  EVQ-PUB02K  [EVQ-PU_BK]
SW3  EVQ-PUB02K  [EVQ-PU_BK]
TP8  TESTPAD-SMT  [TESTPAD-SMT]
TP9  TESTPAD-SMT  [TESTPAD-SMT]
U5  IS25LP016D  QPIFLASH  [SOP8]
U6  PCAL6416AHF  [QFN24-0.5]
U7  24AA02E48  EEPROM-I2C-WP  [SOT23-5]
U8  ICM-20689  [QFN24-0.5-INVEN]
X1  ASDMB-30.000MHZ-LC-T  ASDM  [OSC2520]

### Nets
!FLASH_CS: U5.1(!CE) ; also sheet 5
!IMU_CS: U8.22(!CS) ; also sheet 5
+3V: C27.1 C28.1 C29.1 C30.1 C31.1 R53.2 R54.2 U5.8(VDD) U6.21(VDD(P)) U6.23(VDD(I2C)) U6.24(!RESET) U7.4(VCC) U8.8(VDDIO) U8.13(VDD) X1.1(EN) X1.4(VDD) ; also sheet 1,2,4,5,7,8,14
FLASH_SCK: U5.6(SCK) ; also sheet 5
FLASH_SIO0: U5.5(SI/SIO0) ; also sheet 5
FLASH_SIO1: U5.2(SO/SIO1) ; also sheet 5
FLASH_SIO2: U5.3(!WP!/SIO2) ; also sheet 5
FLASH_SIO3: U5.7(!HOLD!/SIO3) ; also sheet 5
FPGA_CLKIN1: X1.3(OUT) ; also sheet 5
GND: C27.2 C28.2 C29.2 C30.2 C31.2 C32.2 J2.2 J2.4 J2.6 J2.8 J2.10 R51.2 R52.2 SW2.A1 SW2.A2 SW3.A1 SW3.A2 U5.4(VSS) U6.9(VSS) U6.18(ADDR) U6.PAD(VSS) U7.2(GND) U7.5(WP) U8.18(GND) X1.2(GND) ; also sheet 1,2,3,4,5,7,8,9,10,11,12,13,14
IMU_INT: U8.12(INT) ; also sheet 5
IMU_MISO: U8.9(AD0/SDO) ; also sheet 5
IMU_MOSI: U8.24(SDA/SDI) ; also sheet 5
IMU_SCK: U8.23(SCL/SCLK) ; also sheet 5
N$146: D12.A U6.5(P0_4)
N$147: D13.A U6.6(P0_5)
N$148: J2.1 U6.10(P1_0)
N$149: J2.3 U6.11(P1_1)
N$153: J2.5 U6.12(P1_2)
N$154: J2.7 U6.13(P1_3)
N$176: J2.9 U6.14(P1_4)
N$177: SW3.B1 U6.8(P0_7)
N$179: SW2.B1 U6.7(P0_6)
N$192: TP8.1 U6.1(P0_0)
N$193: TP9.1 U6.2(P0_1)
N$195: D12.K R51.1
N$196: D13.K R52.1
N$199: C32.1 U8.10(REGOUT)
PERIPHERAL_SCL: R53.1 U6.19(SCL) U7.1(SCL) ; also sheet 1,5
PERIPHERAL_SDA: R54.1 U6.20(SDA) U7.3(SDA) ; also sheet 1,5
Unconnected: SW2.B2 SW3.B2 U6.3(P0_2) U6.4(P0_3) U6.15(P1_5) U6.16(P1_6) U6.17(P1_7) U6.22(!INT) U8.11(FSYNC)

## Sheet 7 of 14: MD Analog
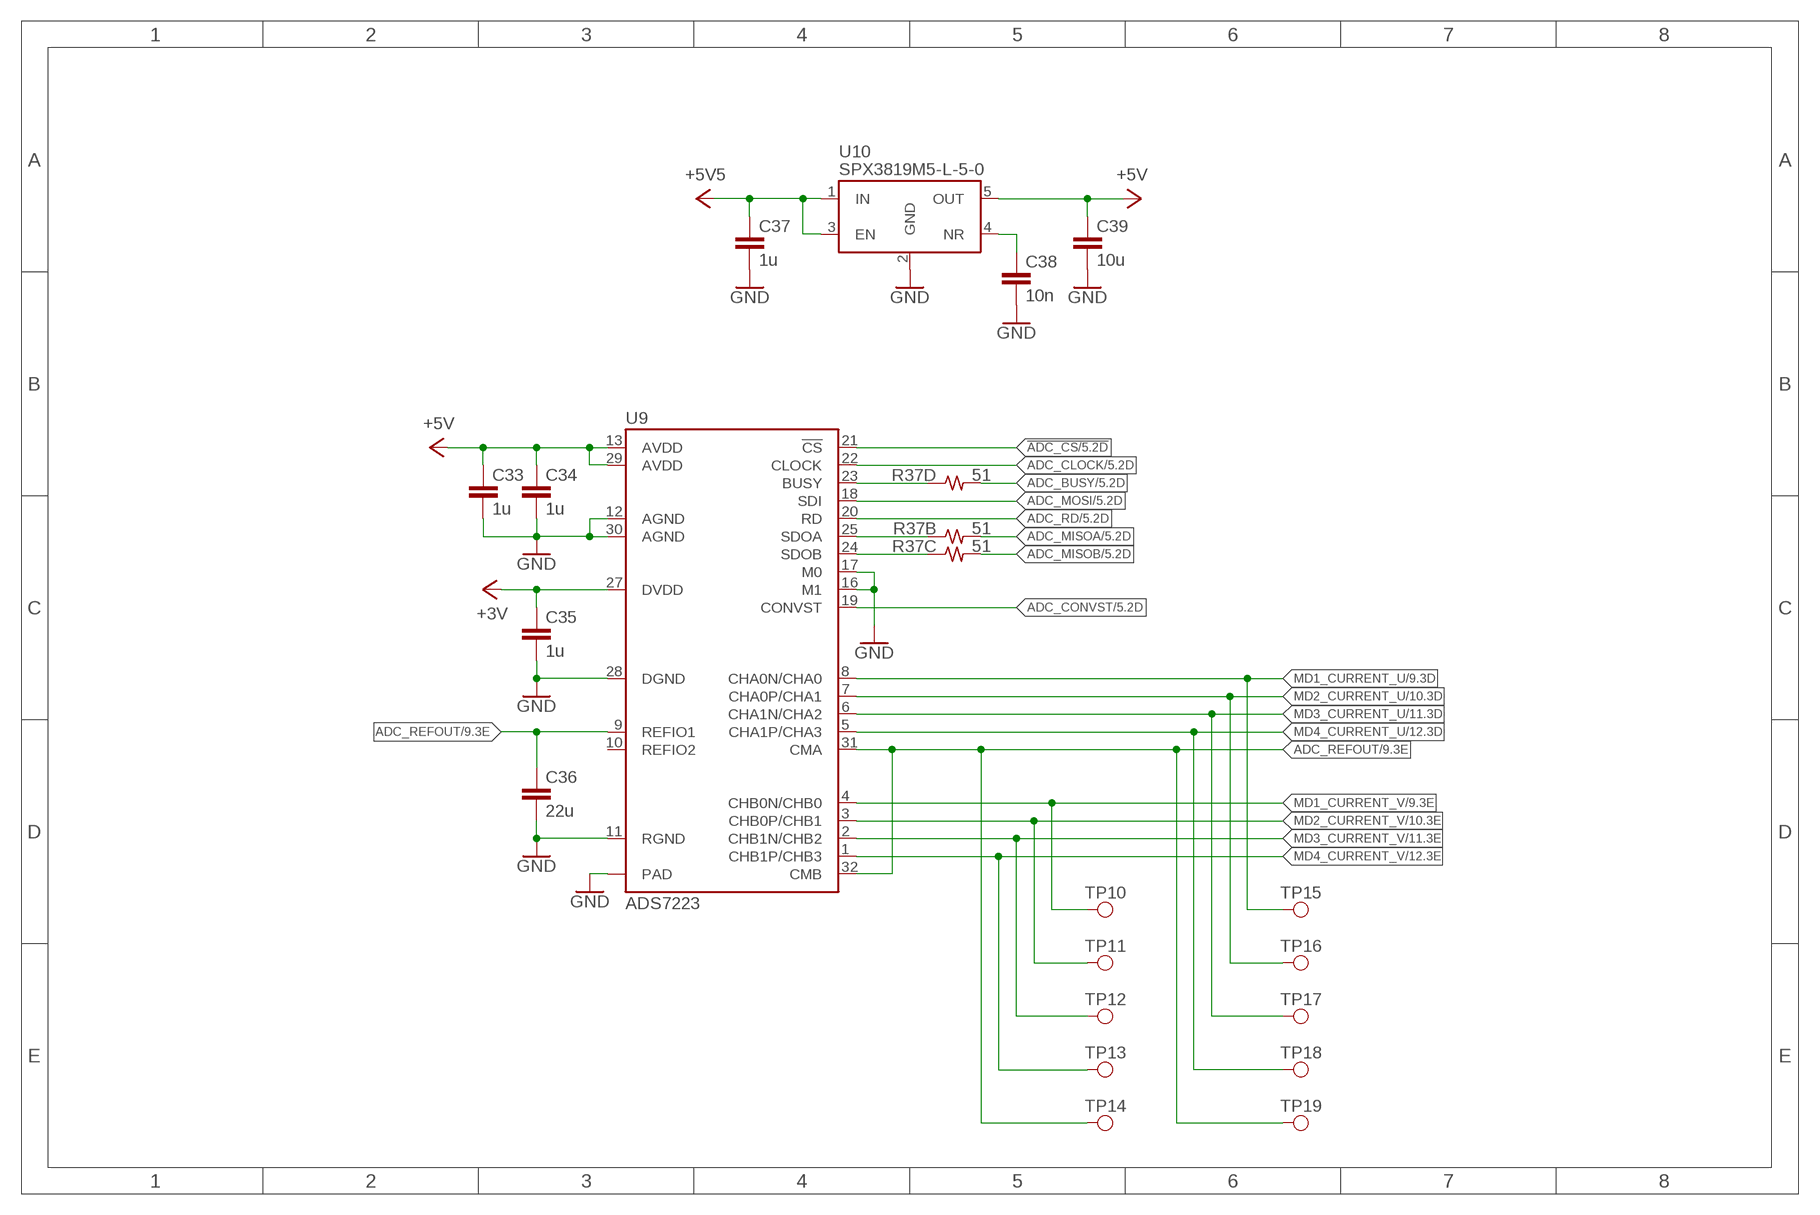
[diagram p6: schematic, sheet 7]

### Parts
C33  1u  C1608  [1608]
C34  1u  C1608  [1608]
C35  1u  C1608  [1608]
C36  22u  C2012  [2012]
C37  1u  C1608  [1608]
C38  10n  C1608  [1608]
C39  10u  C2012  [2012]
TP10  TESTPAD-TH  [TESTPAD-TH]
TP11  TESTPAD-TH  [TESTPAD-TH]
TP12  TESTPAD-TH  [TESTPAD-TH]
TP13  TESTPAD-TH  [TESTPAD-TH]
TP14  TESTPAD-TH  [TESTPAD-TH]
TP15  TESTPAD-TH  [TESTPAD-TH]
TP16  TESTPAD-TH  [TESTPAD-TH]
TP17  TESTPAD-TH  [TESTPAD-TH]
TP18  TESTPAD-TH  [TESTPAD-TH]
TP19  TESTPAD-TH  [TESTPAD-TH]
U9  ADS7223  [QFN32-0.5]
U10  SPX3819M5-L-5-0  [SOT23-5]

### Nets
!ADC_CS: U9.21(!CS) ; also sheet 5
+3V: C35.1 U9.27(DVDD) ; also sheet 1,2,4,5,6,8,14
+5V: C33.1 C34.1 C39.1 U9.13(AVDD) U9.29(AVDD) U10.5(OUT) ; also sheet 9,10,11,12
+5V5: C37.1 U10.1(IN) U10.3(EN) ; also sheet 2,4,9,10,11,12,13
ADC_BUSY: R37.D2 ; also sheet 5
ADC_CLOCK: U9.22(CLOCK) ; also sheet 5
ADC_CONVST: U9.19(CONVST) ; also sheet 5
ADC_MISOA: R37.B2 ; also sheet 5
ADC_MISOB: R37.C2 ; also sheet 5
ADC_MOSI: U9.18(SDI) ; also sheet 5
ADC_RD: U9.20(RD) ; also sheet 5
ADC_REFOUT: C36.1 TP14.1 TP19.1 U9.9(REFIO1) U9.31(CMA) U9.32(CMB) ; also sheet 9,10,11,12
GND: C33.2 C34.2 C35.2 C36.2 C37.2 C38.2 C39.2 U9.11(RGND) U9.12(AGND) U9.16(M1) U9.17(M0) U9.28(DGND) U9.30(AGND) U9.PAD U10.2(GND) ; also sheet 1,2,3,4,5,6,8,9,10,11,12,13,14
MD1_CURRENT_U: TP15.1 U9.8(CHA0N/CHA0) ; also sheet 9
MD1_CURRENT_V: TP10.1 U9.4(CHB0N/CHB0) ; also sheet 9
MD2_CURRENT_U: TP16.1 U9.7(CHA0P/CHA1) ; also sheet 10
MD2_CURRENT_V: TP11.1 U9.3(CHB0P/CHB1) ; also sheet 10
MD3_CURRENT_U: TP17.1 U9.6(CHA1N/CHA2) ; also sheet 11
MD3_CURRENT_V: TP12.1 U9.2(CHB1N/CHB2) ; also sheet 11
MD4_CURRENT_U: TP18.1 U9.5(CHA1P/CHA3) ; also sheet 12
MD4_CURRENT_V: TP13.1 U9.1(CHB1P/CHB3) ; also sheet 12
N$52: C38.1 U10.4(NR)
N$53: R37.D1 U9.23(BUSY)
N$173: R37.B1 U9.25(SDOA)
N$174: R37.C1 U9.24(SDOB)
Unconnected: U9.10(REFIO2)

## Sheet 8 of 14: MD Digital
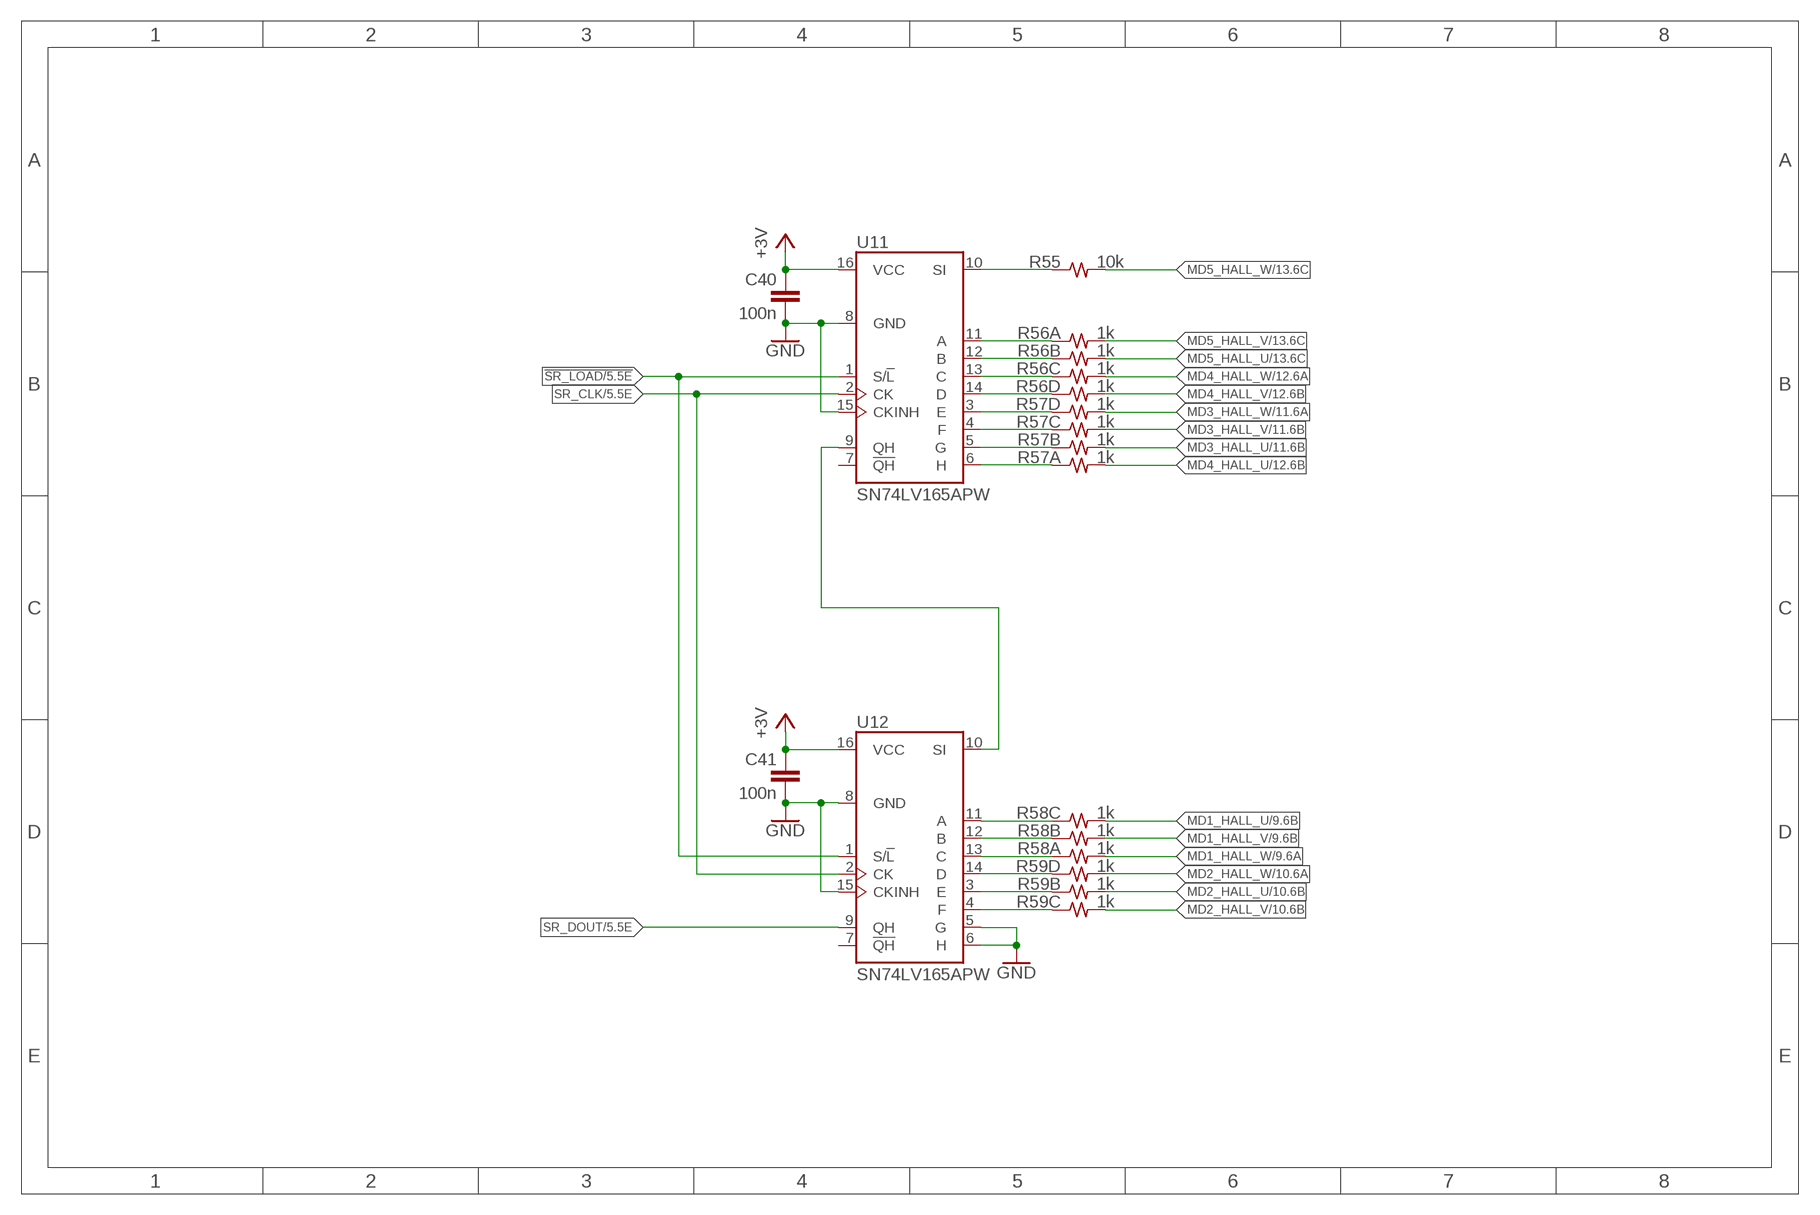
[diagram p7: schematic, sheet 8]

### Parts
C40  100n  C1608  [1608]
C41  100n  C1608  [1608]
R55  10k  R1608  [1608]
R56  1k  R4A1608  [1608-4A]
R57  1k  R4A1608  [1608-4A]
R58  1k  R4A1608  [1608-4A]
R59  1k  R4A1608  [1608-4A]
U11  SN74LV165APW  74165-TSSOP  [TSSOP16]
U12  SN74LV165APW  74165-TSSOP  [TSSOP16]

### Nets
!SR_LOAD: U11.1(S/!L) U12.1(S/!L) ; also sheet 5
+3V: C40.1 C41.1 U11.16(VCC) U12.16(VCC) ; also sheet 1,2,4,5,6,7,14
GND: C40.2 C41.2 U11.8(GND) U11.15(CKINH) U12.5(G) U12.6(H) U12.8(GND) U12.15(CKINH) ; also sheet 1,2,3,4,5,6,7,9,10,11,12,13,14
MD1_HALL_U: R58.C2 ; also sheet 9
MD1_HALL_V: R58.B2 ; also sheet 9
MD1_HALL_W: R58.A2 ; also sheet 9
MD2_HALL_U: R59.B2 ; also sheet 10
MD2_HALL_V: R59.C2 ; also sheet 10
MD2_HALL_W: R59.D2 ; also sheet 10
MD3_HALL_U: R57.B2 ; also sheet 11
MD3_HALL_V: R57.C2 ; also sheet 11
MD3_HALL_W: R57.D2 ; also sheet 11
MD4_HALL_U: R57.A2 ; also sheet 12
MD4_HALL_V: R56.D2 ; also sheet 12
MD4_HALL_W: R56.C2 ; also sheet 12
MD5_HALL_U: R56.B2 ; also sheet 13
MD5_HALL_V: R56.A2 ; also sheet 13
MD5_HALL_W: R55.2 ; also sheet 13
N$73: R59.B1 U12.3(E)
N$75: R59.C1 U12.4(F)
N$76: R59.D1 U12.14(D)
N$79: R58.A1 U12.13(C)
N$80: R58.B1 U12.12(B)
N$81: R58.C1 U12.11(A)
N$151: U11.9(QH) U12.10(SI)
N$158: R57.D1 U11.3(E)
N$159: R57.C1 U11.4(F)
N$160: R57.B1 U11.5(G)
N$161: R57.A1 U11.6(H)
N$162: R56.D1 U11.14(D)
N$163: R56.C1 U11.13(C)
N$164: R56.B1 U11.12(B)
N$165: R56.A1 U11.11(A)
N$166: R55.1 U11.10(SI)
SR_CLK: U11.2(CK) U12.2(CK) ; also sheet 5
SR_DOUT: U12.9(QH) ; also sheet 5
Unconnected: R58.D1 R58.D2 R59.A1 R59.A2 U11.7(!QH) U12.7(!QH)

## Sheet 9 of 14: MD1
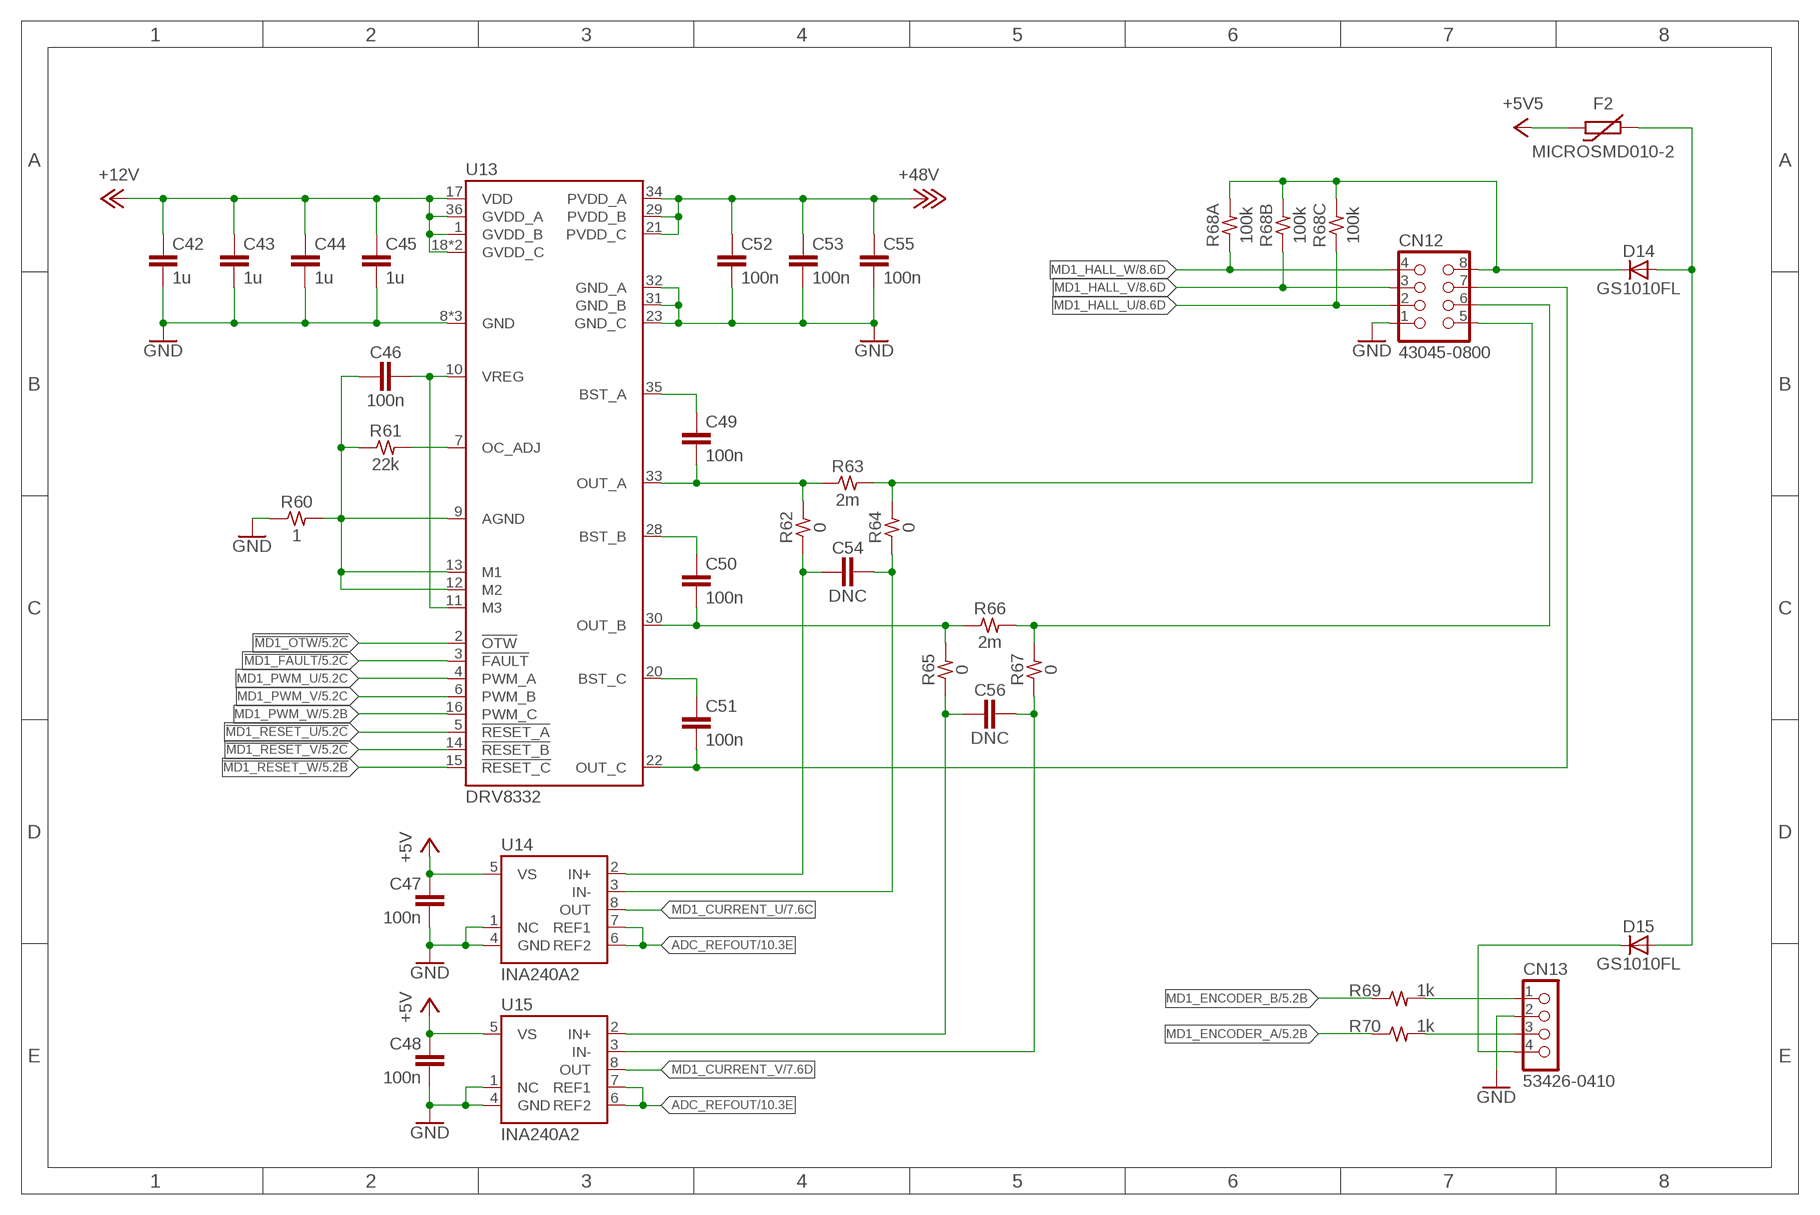
[diagram p8: schematic, sheet 9]

### Parts
C42  1u  C1608  [1608]
C43  1u  C1608  [1608]
C44  1u  C1608  [1608]
C45  1u  C1608  [1608]
C46  100n  C1608  [1608]
C47  100n  C1608  [1608]
C48  100n  C1608  [1608]
C49  100n  C1608  [1608]
C50  100n  C1608  [1608]
C51  100n  C1608  [1608]
C52  100n  C1608  [1608]
C53  100n  C1608  [1608]
C54  DNC  C1608  [1608]
C55  100n  C1608  [1608]
C56  DNC  C1608  [1608]
CN12  43045-0800  [43045-0800]
CN13  53426-0410  [53426-04]
D14  GS1010FL  DIODE-SOD123  [SOD123]
D15  GS1010FL  DIODE-SOD123  [SOD123]
F2  MICROSMD010-2  RF3225  [3225]
R60  1  R1608  [1608]
R61  22k  R1608  [1608]
R62  0  R1608  [1608]
R63  2m  R3216  [3216]
R64  0  R1608  [1608]
R65  0  R1608  [1608]
R66  2m  R3216  [3216]
R67  0  R1608  [1608]
R68  100k  R4A1608  [1608-4A]
R69  1k  R1608  [1608]
R70  1k  R1608  [1608]
U13  DRV8332  [HSSOP36]
U14  INA240A2  [TSSOP8]
U15  INA240A2  [TSSOP8]

### Nets
!MD1_FAULT: U13.3(!FAULT) ; also sheet 5
!MD1_OTW: U13.2(!OTW) ; also sheet 5
!MD1_RESET_U: U13.5(!RESET_A) ; also sheet 5
!MD1_RESET_V: U13.14(!RESET_B) ; also sheet 5
!MD1_RESET_W: U13.15(!RESET_C) ; also sheet 5
+5V: C47.1 C48.1 U14.5(VS) U15.5(VS) ; also sheet 7,10,11,12
+5V5: F2.1 ; also sheet 2,4,7,10,11,12,13
+12V: C42.1 C43.1 C44.1 C45.1 U13.1(GVDD_B) U13.17(VDD) U13.18(GVDD_C) U13.19(GVDD_C) U13.36(GVDD_A) ; also sheet 2,3,10,11,12,13
+48V: C52.1 C53.1 C55.1 U13.21(PVDD_C) U13.29(PVDD_B) U13.34(PVDD_A) ; also sheet 3,10,11,12,13
ADC_REFOUT: U14.6(REF2) U14.7(REF1) U15.6(REF2) U15.7(REF1) ; also sheet 7,10,11,12
GND: C42.2 C43.2 C44.2 C45.2 C47.2 C48.2 C52.2 C53.2 C55.2 CN12.1 CN13.2 R60.1 U13.8(GND) U13.23(GND_C) U13.24(GND) U13.25(GND) U13.31(GND_B) U13.32(GND_A) U14.1(NC) U14.4(GND) U15.1(NC) U15.4(GND) ; also sheet 1,2,3,4,5,6,7,8,10,11,12,13,14
MD1_CURRENT_U: U14.8(OUT) ; also sheet 7
MD1_CURRENT_V: U15.8(OUT) ; also sheet 7
MD1_ENCODER_A: R70.1 ; also sheet 5
MD1_ENCODER_B: R69.1 ; also sheet 5
MD1_HALL_U: CN12.2 R68.C1 ; also sheet 8
MD1_HALL_V: CN12.3 R68.B1 ; also sheet 8
MD1_HALL_W: CN12.4 R68.A1 ; also sheet 8
MD1_PWM_U: U13.4(PWM_A) ; also sheet 5
MD1_PWM_V: U13.6(PWM_B) ; also sheet 5
MD1_PWM_W: U13.16(PWM_C) ; also sheet 5
N$45: C49.2 R62.2 R63.1 U13.33(OUT_A)
N$46: CN12.5 R63.2 R64.2
N$60: R61.2 U13.7(OC_ADJ)
N$61: C46.2 U13.10(VREG) U13.11(M3)
N$62: C46.1 R60.2 R61.1 U13.9(AGND) U13.12(M2) U13.13(M1)
N$63: C51.2 CN12.7 U13.22(OUT_C)
N$64: C56.1 R65.1 U15.2(IN+)
N$65: C54.1 R62.1 U14.2(IN+)
N$66: C49.1 U13.35(BST_A)
N$67: C50.1 U13.28(BST_B)
N$68: C51.1 U13.20(BST_C)
N$69: CN13.1 R69.2
N$70: C54.2 R64.1 U14.3(IN-)
N$71: C56.2 R67.1 U15.3(IN-)
N$72: D14.A D15.A F2.2
N$74: CN13.4 D15.K
N$77: CN12.8 D14.K R68.A2 R68.B2 R68.C2
N$78: CN13.3 R70.2
N$82: C50.2 R65.2 R66.1 U13.30(OUT_B)
N$83: CN12.6 R66.2 R67.2
Unconnected: R68.D1 R68.D2

## Sheet 10 of 14: MD2
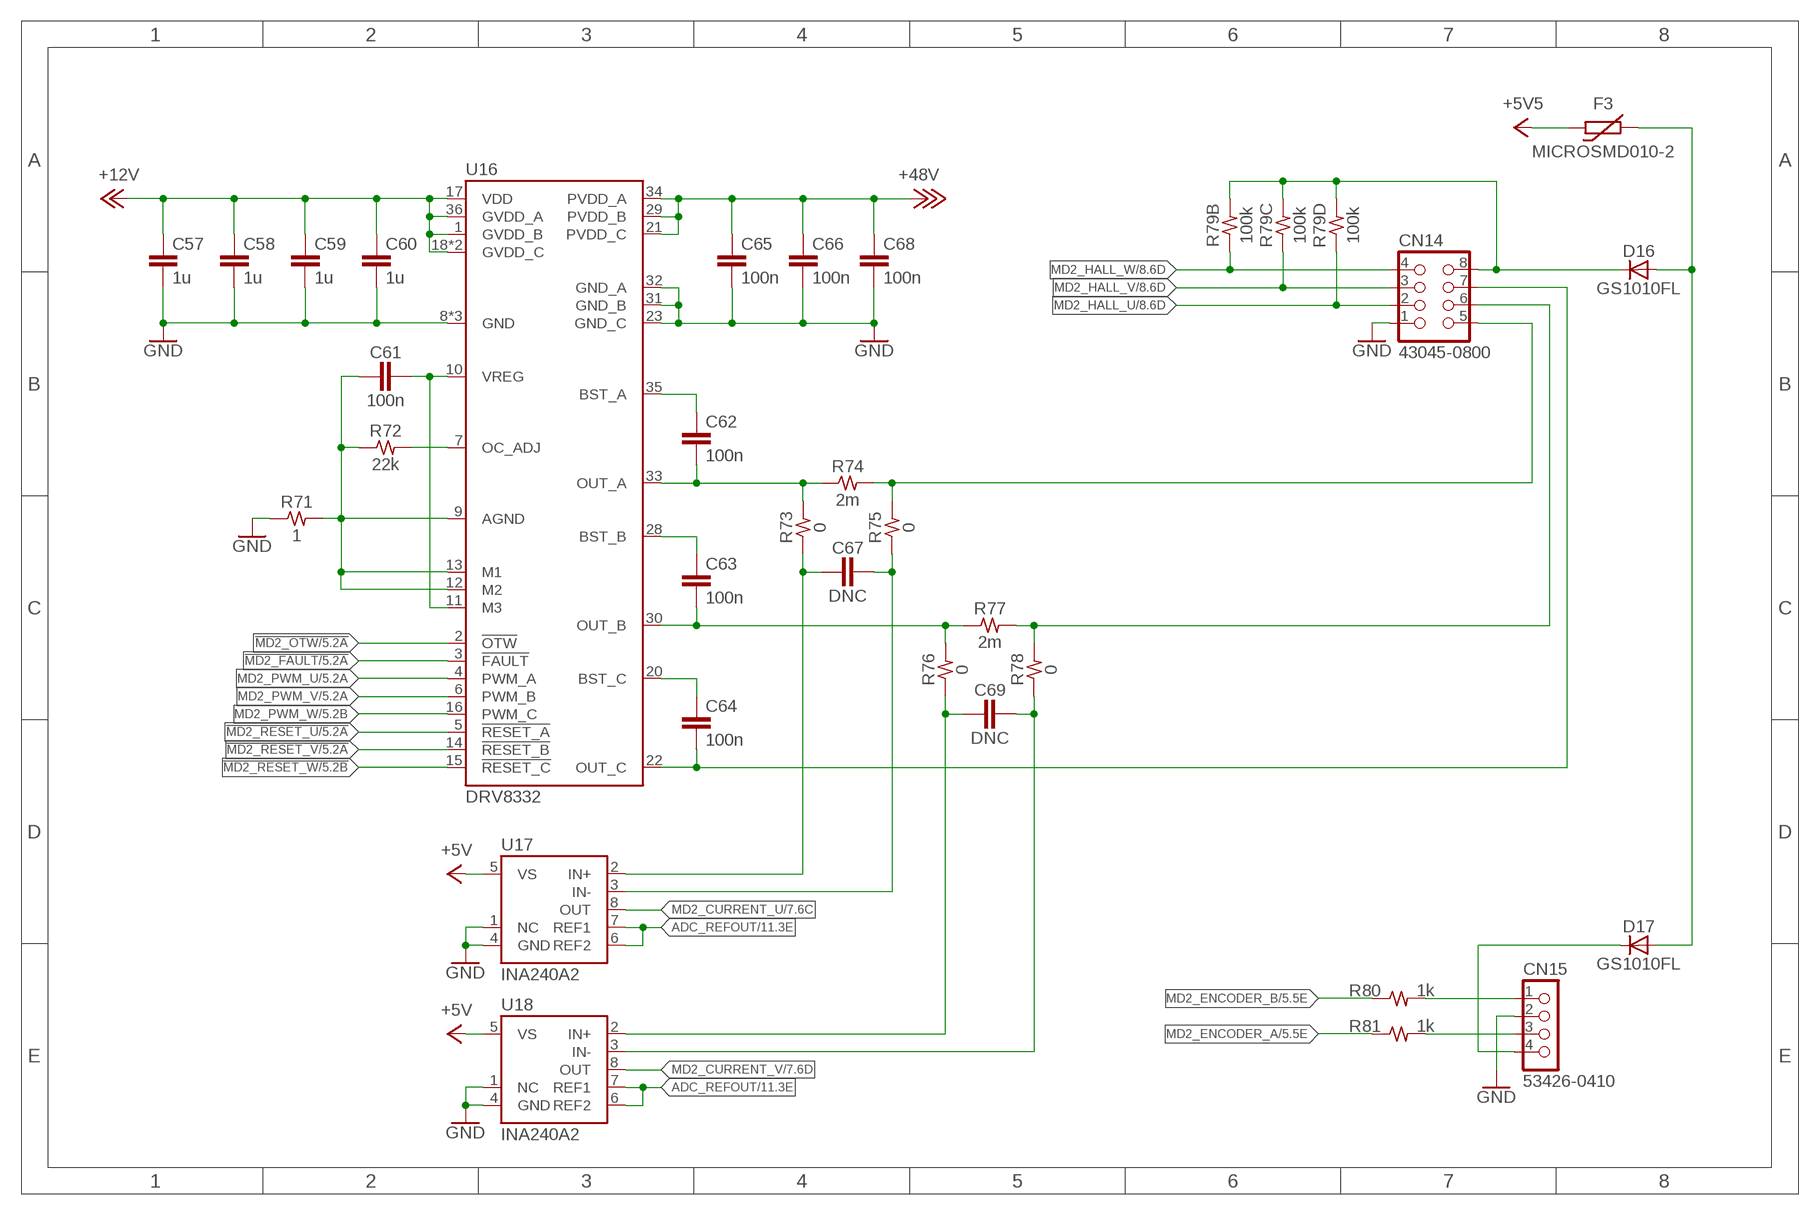
[diagram p9: schematic, sheet 10]

### Parts
C57  1u  C1608  [1608]
C58  1u  C1608  [1608]
C59  1u  C1608  [1608]
C60  1u  C1608  [1608]
C61  100n  C1608  [1608]
C62  100n  C1608  [1608]
C63  100n  C1608  [1608]
C64  100n  C1608  [1608]
C65  100n  C1608  [1608]
C66  100n  C1608  [1608]
C67  DNC  C1608  [1608]
C68  100n  C1608  [1608]
C69  DNC  C1608  [1608]
CN14  43045-0800  [43045-0800]
CN15  53426-0410  [53426-04]
D16  GS1010FL  DIODE-SOD123  [SOD123]
D17  GS1010FL  DIODE-SOD123  [SOD123]
F3  MICROSMD010-2  RF3225  [3225]
R71  1  R1608  [1608]
R72  22k  R1608  [1608]
R73  0  R1608  [1608]
R74  2m  R3216  [3216]
R75  0  R1608  [1608]
R76  0  R1608  [1608]
R77  2m  R3216  [3216]
R78  0  R1608  [1608]
R79  100k  R4A1608  [1608-4A]
R80  1k  R1608  [1608]
R81  1k  R1608  [1608]
U16  DRV8332  [HSSOP36]
U17  INA240A2  [TSSOP8]
U18  INA240A2  [TSSOP8]

### Nets
!MD2_FAULT: U16.3(!FAULT) ; also sheet 5
!MD2_OTW: U16.2(!OTW) ; also sheet 5
!MD2_RESET_U: U16.5(!RESET_A) ; also sheet 5
!MD2_RESET_V: U16.14(!RESET_B) ; also sheet 5
!MD2_RESET_W: U16.15(!RESET_C) ; also sheet 5
+5V: U17.5(VS) U18.5(VS) ; also sheet 7,9,11,12
+5V5: F3.1 ; also sheet 2,4,7,9,11,12,13
+12V: C57.1 C58.1 C59.1 C60.1 U16.1(GVDD_B) U16.17(VDD) U16.18(GVDD_C) U16.19(GVDD_C) U16.36(GVDD_A) ; also sheet 2,3,9,11,12,13
+48V: C65.1 C66.1 C68.1 U16.21(PVDD_C) U16.29(PVDD_B) U16.34(PVDD_A) ; also sheet 3,9,11,12,13
ADC_REFOUT: U17.6(REF2) U17.7(REF1) U18.6(REF2) U18.7(REF1) ; also sheet 7,9,11,12
GND: C57.2 C58.2 C59.2 C60.2 C65.2 C66.2 C68.2 CN14.1 CN15.2 R71.1 U16.8(GND) U16.23(GND_C) U16.24(GND) U16.25(GND) U16.31(GND_B) U16.32(GND_A) U17.1(NC) U17.4(GND) U18.1(NC) U18.4(GND) ; also sheet 1,2,3,4,5,6,7,8,9,11,12,13,14
MD2_CURRENT_U: U17.8(OUT) ; also sheet 7
MD2_CURRENT_V: U18.8(OUT) ; also sheet 7
MD2_ENCODER_A: R81.1 ; also sheet 5
MD2_ENCODER_B: R80.1 ; also sheet 5
MD2_HALL_U: CN14.2 R79.D1 ; also sheet 8
MD2_HALL_V: CN14.3 R79.C1 ; also sheet 8
MD2_HALL_W: CN14.4 R79.B1 ; also sheet 8
MD2_PWM_U: U16.4(PWM_A) ; also sheet 5
MD2_PWM_V: U16.6(PWM_B) ; also sheet 5
MD2_PWM_W: U16.16(PWM_C) ; also sheet 5
N$84: R72.2 U16.7(OC_ADJ)
N$85: C61.2 U16.10(VREG) U16.11(M3)
N$86: C61.1 R71.2 R72.1 U16.9(AGND) U16.12(M2) U16.13(M1)
N$87: C64.2 CN14.7 U16.22(OUT_C)
N$88: C69.1 R76.1 U18.2(IN+)
N$89: C67.1 R73.1 U17.2(IN+)
N$90: C62.1 U16.35(BST_A)
N$91: C63.1 U16.28(BST_B)
N$92: C64.1 U16.20(BST_C)
N$93: CN14.8 D16.K R79.B2 R79.C2 R79.D2
N$94: C67.2 R75.1 U17.3(IN-)
N$95: C69.2 R78.1 U18.3(IN-)
N$96: CN15.4 D17.K
N$97: D16.A D17.A F3.2
N$98: C62.2 R73.2 R74.1 U16.33(OUT_A)
N$99: CN14.5 R74.2 R75.2
N$100: C63.2 R76.2 R77.1 U16.30(OUT_B)
N$101: CN14.6 R77.2 R78.2
N$156: CN15.1 R80.2
N$157: CN15.3 R81.2
Unconnected: R79.A1 R79.A2

## Sheet 11 of 14: MD3
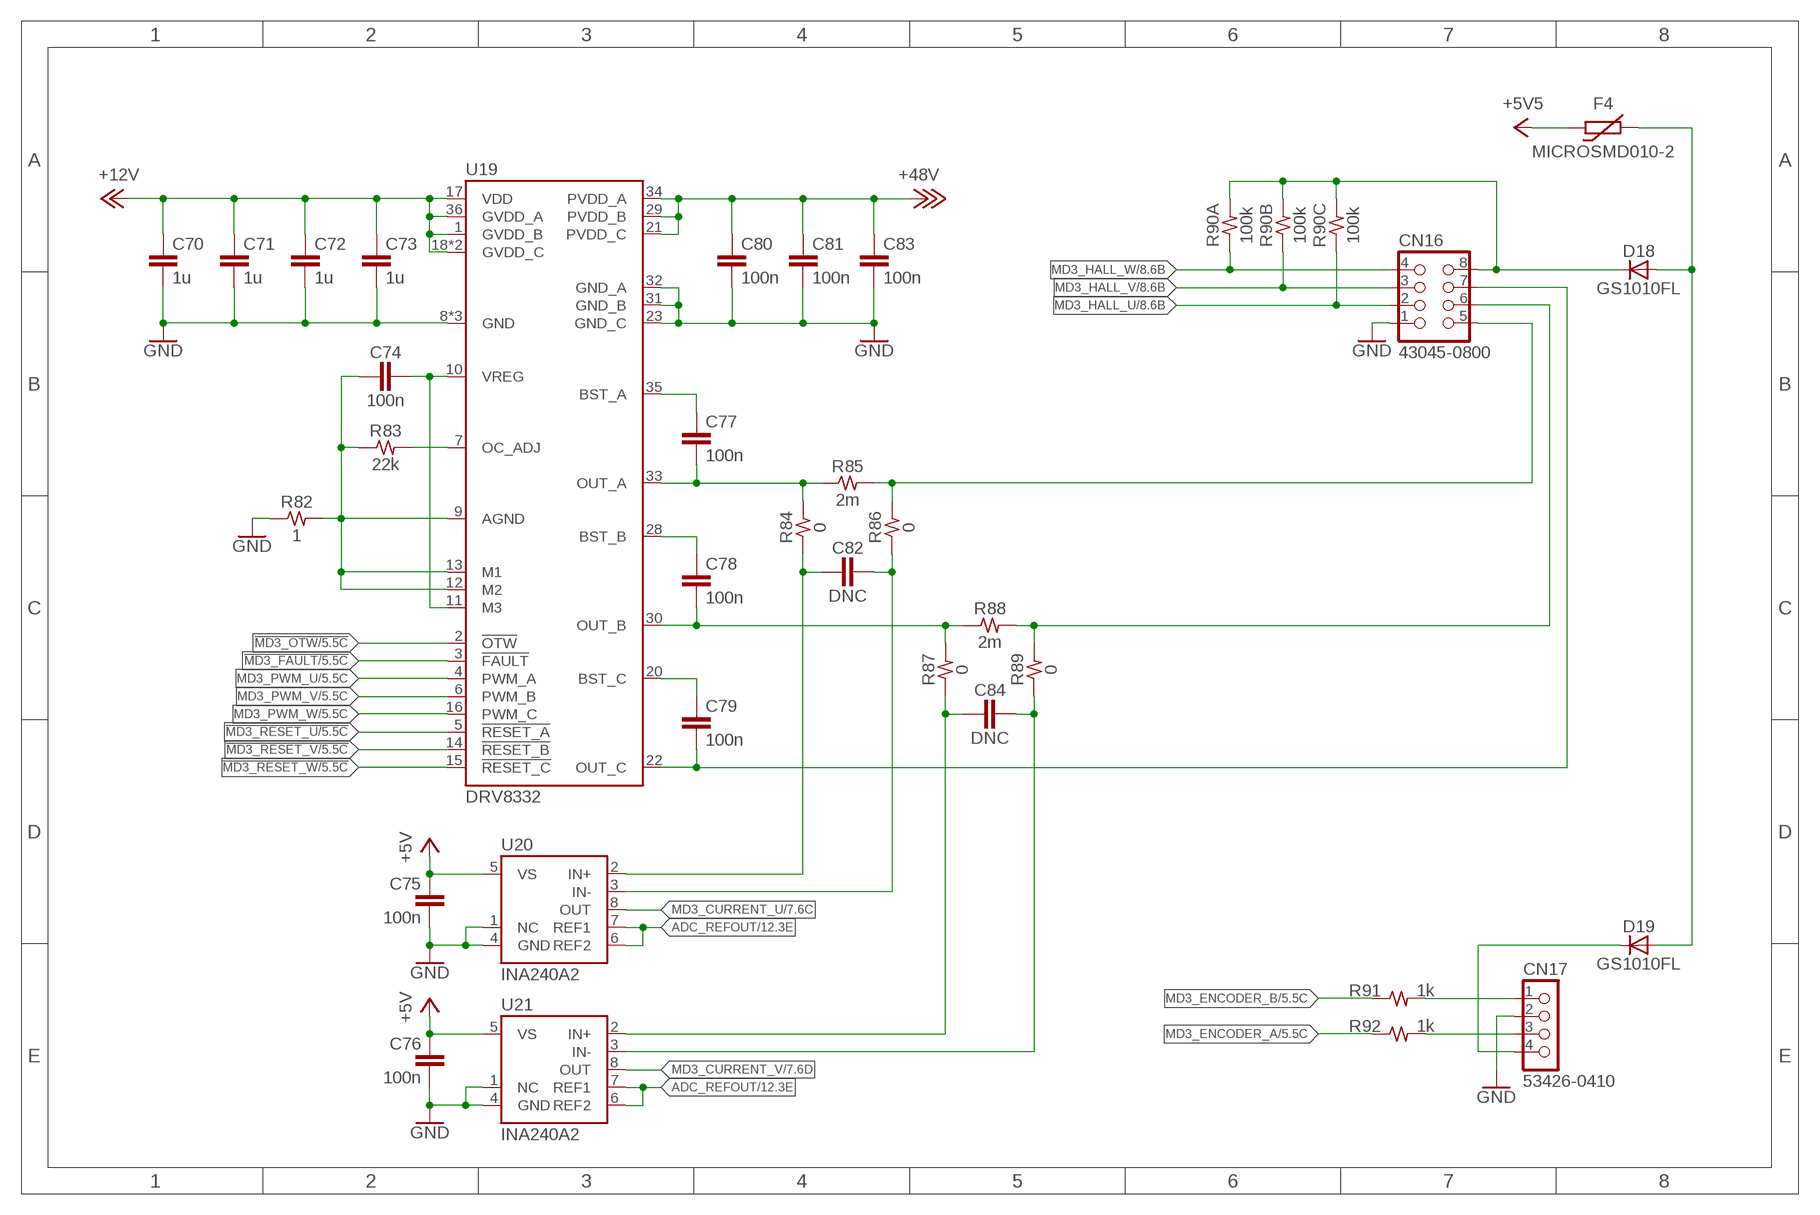
[diagram p10: schematic, sheet 11]

### Parts
C70  1u  C1608  [1608]
C71  1u  C1608  [1608]
C72  1u  C1608  [1608]
C73  1u  C1608  [1608]
C74  100n  C1608  [1608]
C75  100n  C1608  [1608]
C76  100n  C1608  [1608]
C77  100n  C1608  [1608]
C78  100n  C1608  [1608]
C79  100n  C1608  [1608]
C80  100n  C1608  [1608]
C81  100n  C1608  [1608]
C82  DNC  C1608  [1608]
C83  100n  C1608  [1608]
C84  DNC  C1608  [1608]
CN16  43045-0800  [43045-0800]
CN17  53426-0410  [53426-04]
D18  GS1010FL  DIODE-SOD123  [SOD123]
D19  GS1010FL  DIODE-SOD123  [SOD123]
F4  MICROSMD010-2  RF3225  [3225]
R82  1  R1608  [1608]
R83  22k  R1608  [1608]
R84  0  R1608  [1608]
R85  2m  R3216  [3216]
R86  0  R1608  [1608]
R87  0  R1608  [1608]
R88  2m  R3216  [3216]
R89  0  R1608  [1608]
R90  100k  R4A1608  [1608-4A]
R91  1k  R1608  [1608]
R92  1k  R1608  [1608]
U19  DRV8332  [HSSOP36]
U20  INA240A2  [TSSOP8]
U21  INA240A2  [TSSOP8]

### Nets
!MD3_FAULT: U19.3(!FAULT) ; also sheet 5
!MD3_OTW: U19.2(!OTW) ; also sheet 5
!MD3_RESET_U: U19.5(!RESET_A) ; also sheet 5
!MD3_RESET_V: U19.14(!RESET_B) ; also sheet 5
!MD3_RESET_W: U19.15(!RESET_C) ; also sheet 5
+5V: C75.1 C76.1 U20.5(VS) U21.5(VS) ; also sheet 7,9,10,12
+5V5: F4.1 ; also sheet 2,4,7,9,10,12,13
+12V: C70.1 C71.1 C72.1 C73.1 U19.1(GVDD_B) U19.17(VDD) U19.18(GVDD_C) U19.19(GVDD_C) U19.36(GVDD_A) ; also sheet 2,3,9,10,12,13
+48V: C80.1 C81.1 C83.1 U19.21(PVDD_C) U19.29(PVDD_B) U19.34(PVDD_A) ; also sheet 3,9,10,12,13
ADC_REFOUT: U20.6(REF2) U20.7(REF1) U21.6(REF2) U21.7(REF1) ; also sheet 7,9,10,12
GND: C70.2 C71.2 C72.2 C73.2 C75.2 C76.2 C80.2 C81.2 C83.2 CN16.1 CN17.2 R82.1 U19.8(GND) U19.23(GND_C) U19.24(GND) U19.25(GND) U19.31(GND_B) U19.32(GND_A) U20.1(NC) U20.4(GND) U21.1(NC) U21.4(GND) ; also sheet 1,2,3,4,5,6,7,8,9,10,12,13,14
MD3_CURRENT_U: U20.8(OUT) ; also sheet 7
MD3_CURRENT_V: U21.8(OUT) ; also sheet 7
MD3_ENCODER_A: R92.1 ; also sheet 5
MD3_ENCODER_B: R91.1 ; also sheet 5
MD3_HALL_U: CN16.2 R90.C1 ; also sheet 8
MD3_HALL_V: CN16.3 R90.B1 ; also sheet 8
MD3_HALL_W: CN16.4 R90.A1 ; also sheet 8
MD3_PWM_U: U19.4(PWM_A) ; also sheet 5
MD3_PWM_V: U19.6(PWM_B) ; also sheet 5
MD3_PWM_W: U19.16(PWM_C) ; also sheet 5
N$102: R83.2 U19.7(OC_ADJ)
N$103: C74.2 U19.10(VREG) U19.11(M3)
N$104: C74.1 R82.2 R83.1 U19.9(AGND) U19.12(M2) U19.13(M1)
N$105: C79.2 CN16.7 U19.22(OUT_C)
N$106: C84.1 R87.1 U21.2(IN+)
N$107: C82.1 R84.1 U20.2(IN+)
N$108: C77.1 U19.35(BST_A)
N$109: C78.1 U19.28(BST_B)
N$110: C79.1 U19.20(BST_C)
N$111: CN16.8 D18.K R90.A2 R90.B2 R90.C2
N$112: C82.2 R86.1 U20.3(IN-)
N$113: C84.2 R89.1 U21.3(IN-)
N$114: CN17.4 D19.K
N$115: D18.A D19.A F4.2
N$116: C77.2 R84.2 R85.1 U19.33(OUT_A)
N$117: CN16.5 R85.2 R86.2
N$118: C78.2 R87.2 R88.1 U19.30(OUT_B)
N$119: CN16.6 R88.2 R89.2
N$167: CN17.1 R91.2
N$168: CN17.3 R92.2
Unconnected: R90.D1 R90.D2

## Sheet 12 of 14: MD4
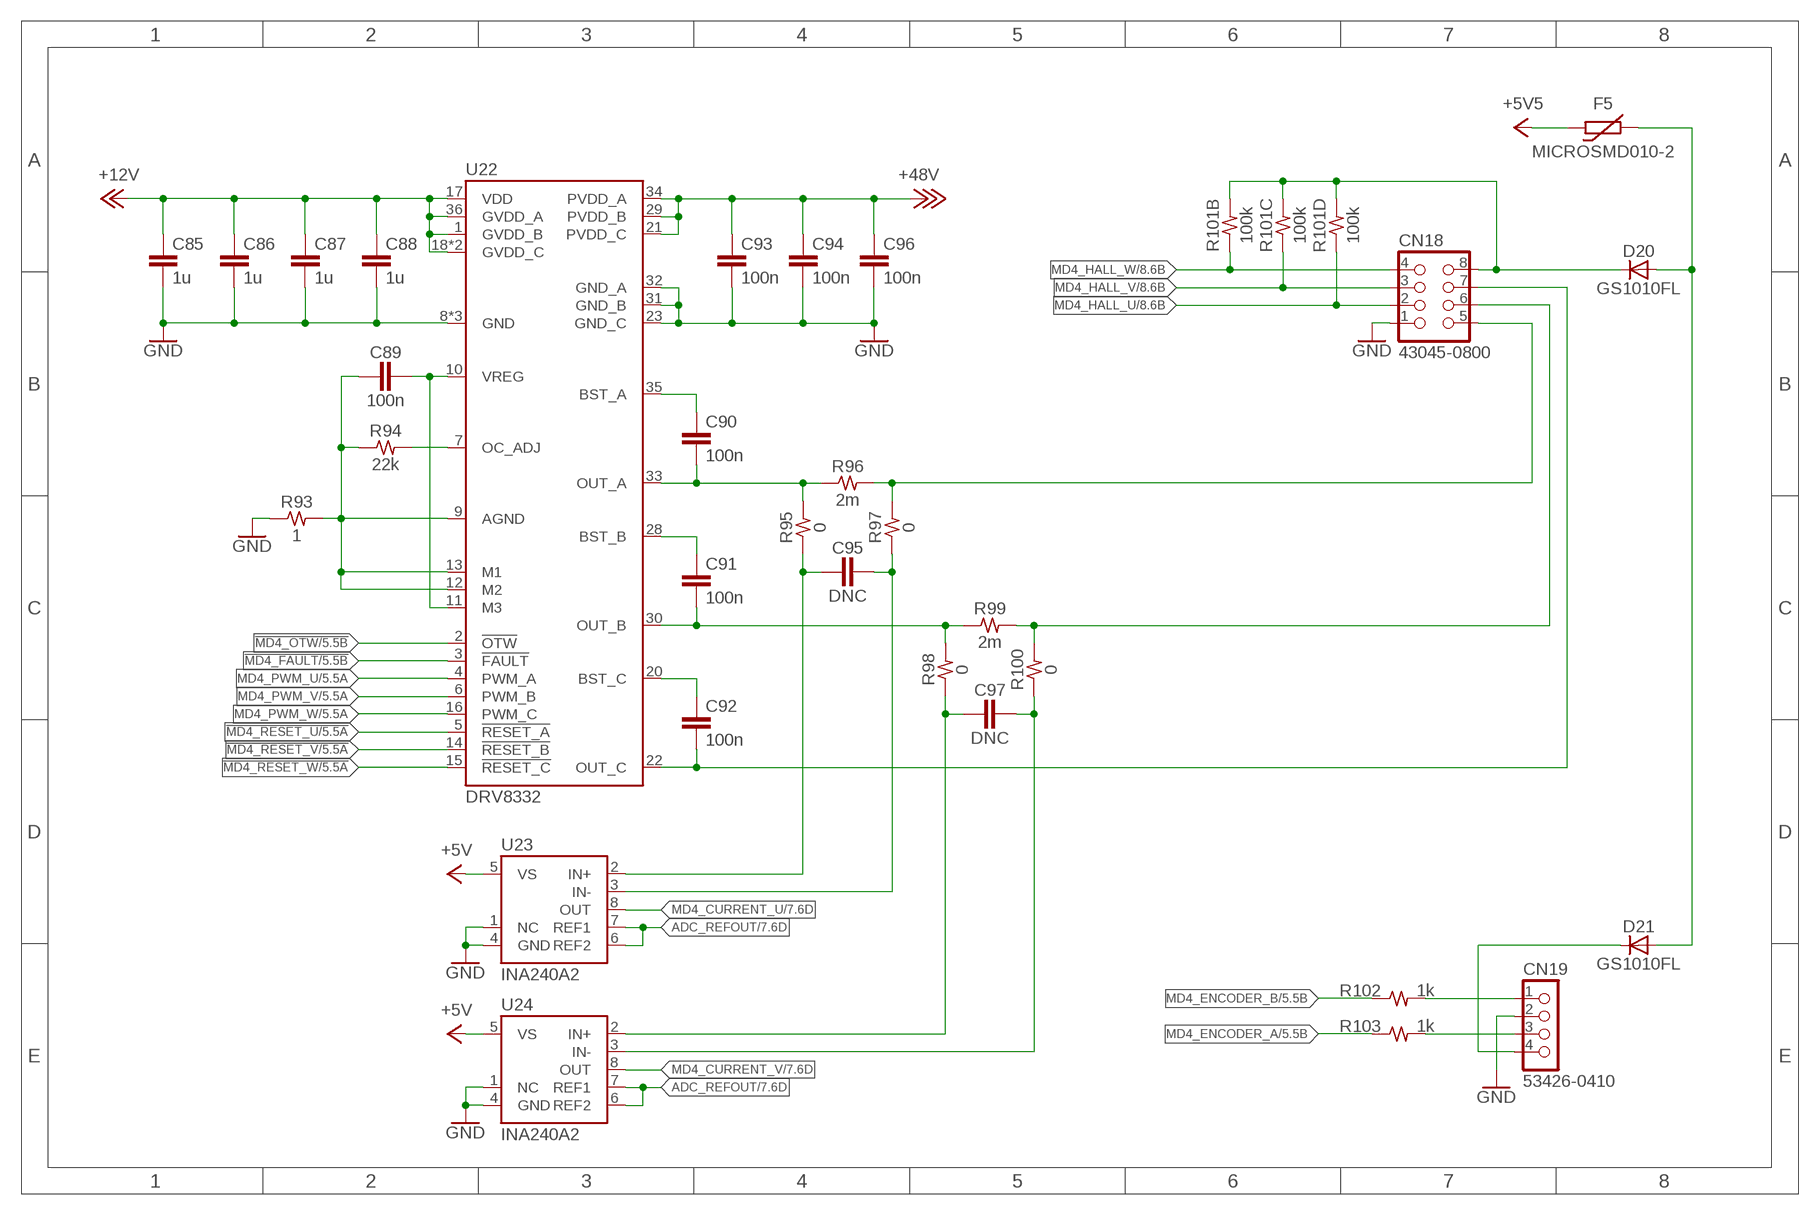
[diagram p11: schematic, sheet 12]

### Parts
C85  1u  C1608  [1608]
C86  1u  C1608  [1608]
C87  1u  C1608  [1608]
C88  1u  C1608  [1608]
C89  100n  C1608  [1608]
C90  100n  C1608  [1608]
C91  100n  C1608  [1608]
C92  100n  C1608  [1608]
C93  100n  C1608  [1608]
C94  100n  C1608  [1608]
C95  DNC  C1608  [1608]
C96  100n  C1608  [1608]
C97  DNC  C1608  [1608]
CN18  43045-0800  [43045-0800]
CN19  53426-0410  [53426-04]
D20  GS1010FL  DIODE-SOD123  [SOD123]
D21  GS1010FL  DIODE-SOD123  [SOD123]
F5  MICROSMD010-2  RF3225  [3225]
R93  1  R1608  [1608]
R94  22k  R1608  [1608]
R95  0  R1608  [1608]
R96  2m  R3216  [3216]
R97  0  R1608  [1608]
R98  0  R1608  [1608]
R99  2m  R3216  [3216]
R100  0  R1608  [1608]
R101  100k  R4A1608  [1608-4A]
R102  1k  R1608  [1608]
R103  1k  R1608  [1608]
U22  DRV8332  [HSSOP36]
U23  INA240A2  [TSSOP8]
U24  INA240A2  [TSSOP8]

### Nets
!MD4_FAULT: U22.3(!FAULT) ; also sheet 5
!MD4_OTW: U22.2(!OTW) ; also sheet 5
!MD4_RESET_U: U22.5(!RESET_A) ; also sheet 5
!MD4_RESET_V: U22.14(!RESET_B) ; also sheet 5
!MD4_RESET_W: U22.15(!RESET_C) ; also sheet 5
+5V: U23.5(VS) U24.5(VS) ; also sheet 7,9,10,11
+5V5: F5.1 ; also sheet 2,4,7,9,10,11,13
+12V: C85.1 C86.1 C87.1 C88.1 U22.1(GVDD_B) U22.17(VDD) U22.18(GVDD_C) U22.19(GVDD_C) U22.36(GVDD_A) ; also sheet 2,3,9,10,11,13
+48V: C93.1 C94.1 C96.1 U22.21(PVDD_C) U22.29(PVDD_B) U22.34(PVDD_A) ; also sheet 3,9,10,11,13
ADC_REFOUT: U23.6(REF2) U23.7(REF1) U24.6(REF2) U24.7(REF1) ; also sheet 7,9,10,11
GND: C85.2 C86.2 C87.2 C88.2 C93.2 C94.2 C96.2 CN18.1 CN19.2 R93.1 U22.8(GND) U22.23(GND_C) U22.24(GND) U22.25(GND) U22.31(GND_B) U22.32(GND_A) U23.1(NC) U23.4(GND) U24.1(NC) U24.4(GND) ; also sheet 1,2,3,4,5,6,7,8,9,10,11,13,14
MD4_CURRENT_U: U23.8(OUT) ; also sheet 7
MD4_CURRENT_V: U24.8(OUT) ; also sheet 7
MD4_ENCODER_A: R103.1 ; also sheet 5
MD4_ENCODER_B: R102.1 ; also sheet 5
MD4_HALL_U: CN18.2 R101.D1 ; also sheet 8
MD4_HALL_V: CN18.3 R101.C1 ; also sheet 8
MD4_HALL_W: CN18.4 R101.B1 ; also sheet 8
MD4_PWM_U: U22.4(PWM_A) ; also sheet 5
MD4_PWM_V: U22.6(PWM_B) ; also sheet 5
MD4_PWM_W: U22.16(PWM_C) ; also sheet 5
N$120: R94.2 U22.7(OC_ADJ)
N$121: C89.2 U22.10(VREG) U22.11(M3)
N$122: C89.1 R93.2 R94.1 U22.9(AGND) U22.12(M2) U22.13(M1)
N$123: C92.2 CN18.7 U22.22(OUT_C)
N$124: C97.1 R98.1 U24.2(IN+)
N$125: C95.1 R95.1 U23.2(IN+)
N$126: C90.1 U22.35(BST_A)
N$127: C91.1 U22.28(BST_B)
N$128: C92.1 U22.20(BST_C)
N$129: CN18.8 D20.K R101.B2 R101.C2 R101.D2
N$130: C95.2 R97.1 U23.3(IN-)
N$131: C97.2 R100.1 U24.3(IN-)
N$132: CN19.4 D21.K
N$133: D20.A D21.A F5.2
N$134: C90.2 R95.2 R96.1 U22.33(OUT_A)
N$135: CN18.5 R96.2 R97.2
N$136: C91.2 R98.2 R99.1 U22.30(OUT_B)
N$137: CN18.6 R99.2 R100.2
N$169: CN19.1 R102.2
N$170: CN19.3 R103.2
Unconnected: R101.A1 R101.A2

## Sheet 13 of 14: MD5
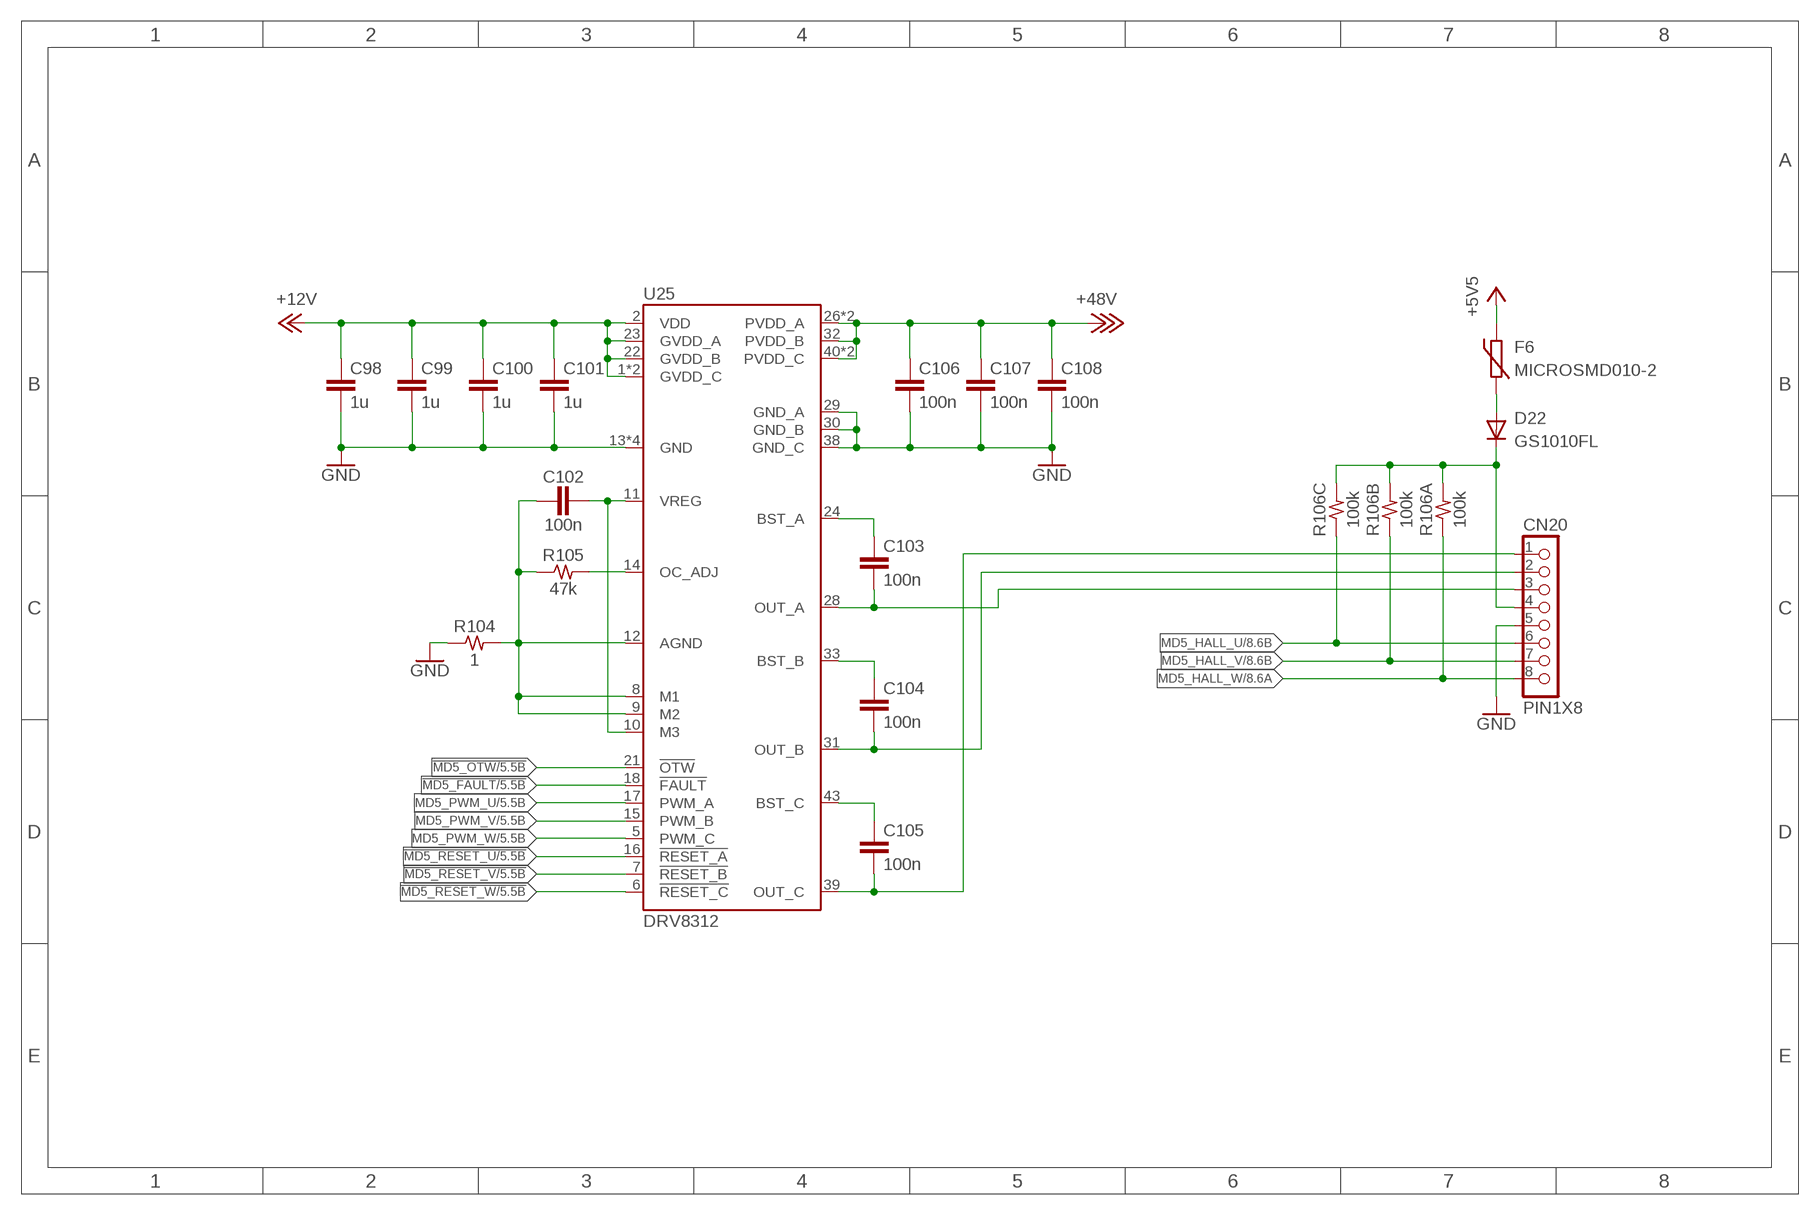
[diagram p12: schematic, sheet 13]

### Parts
C98  1u  C1608  [1608]
C99  1u  C1608  [1608]
C100  1u  C1608  [1608]
C101  1u  C1608  [1608]
C102  100n  C1608  [1608]
C103  100n  C1608  [1608]
C104  100n  C1608  [1608]
C105  100n  C1608  [1608]
C106  100n  C1608  [1608]
C107  100n  C1608  [1608]
C108  100n  C1608  [1608]
CN20  PIN1X8  [PIN1X8]
D22  GS1010FL  DIODE-SOD123  [SOD123]
F6  MICROSMD010-2  RF3225  [3225]
R104  1  R1608  [1608]
R105  47k  R1608  [1608]
R106  100k  R4A1608  [1608-4A]
U25  DRV8312  [HTSSOP44]

### Nets
!MD5_FAULT: U25.18(!FAULT) ; also sheet 5
!MD5_OTW: U25.21(!OTW) ; also sheet 5
!MD5_RESET_U: U25.16(!RESET_A) ; also sheet 5
!MD5_RESET_V: U25.7(!RESET_B) ; also sheet 5
!MD5_RESET_W: U25.6(!RESET_C) ; also sheet 5
+5V5: F6.1 ; also sheet 2,4,7,9,10,11,12
+12V: C98.1 C99.1 C100.1 C101.1 U25.1(GVDD_C) U25.2(VDD) U25.22(GVDD_B) U25.23(GVDD_A) U25.44(GVDD_C) ; also sheet 2,3,9,10,11,12
+48V: C106.1 C107.1 C108.1 U25.26(PVDD_A) U25.27(PVDD_A) U25.32(PVDD_B) U25.40(PVDD_C) U25.41(PVDD_C) ; also sheet 3,9,10,11,12
GND: C98.2 C99.2 C100.2 C101.2 C106.2 C107.2 C108.2 CN20.5 R104.1 U25.13(GND) U25.29(GND_A) U25.30(GND_B) U25.36(GND) U25.37(GND) U25.38(GND_C) U25.PAD(GND) ; also sheet 1,2,3,4,5,6,7,8,9,10,11,12,14
MD5_HALL_U: CN20.6 R106.C1 ; also sheet 8
MD5_HALL_V: CN20.7 R106.B1 ; also sheet 8
MD5_HALL_W: CN20.8 R106.A1 ; also sheet 8
MD5_PWM_U: U25.17(PWM_A) ; also sheet 5
MD5_PWM_V: U25.15(PWM_B) ; also sheet 5
MD5_PWM_W: U25.5(PWM_C) ; also sheet 5
N$47: CN20.4 D22.K R106.A2 R106.B2 R106.C2
N$48: R105.2 U25.14(OC_ADJ)
N$49: D22.A F6.2
N$50: C102.2 U25.10(M3) U25.11(VREG)
N$51: C102.1 R104.2 R105.1 U25.8(M1) U25.9(M2) U25.12(AGND)
N$54: C105.2 CN20.1 U25.39(OUT_C)
N$55: C104.2 CN20.2 U25.31(OUT_B)
N$56: C103.2 CN20.3 U25.28(OUT_A)
N$57: C103.1 U25.24(BST_A)
N$58: C104.1 U25.33(BST_B)
N$59: C105.1 U25.43(BST_C)
Unconnected: R106.D1 R106.D2

## Sheet 14 of 14: Decoupling
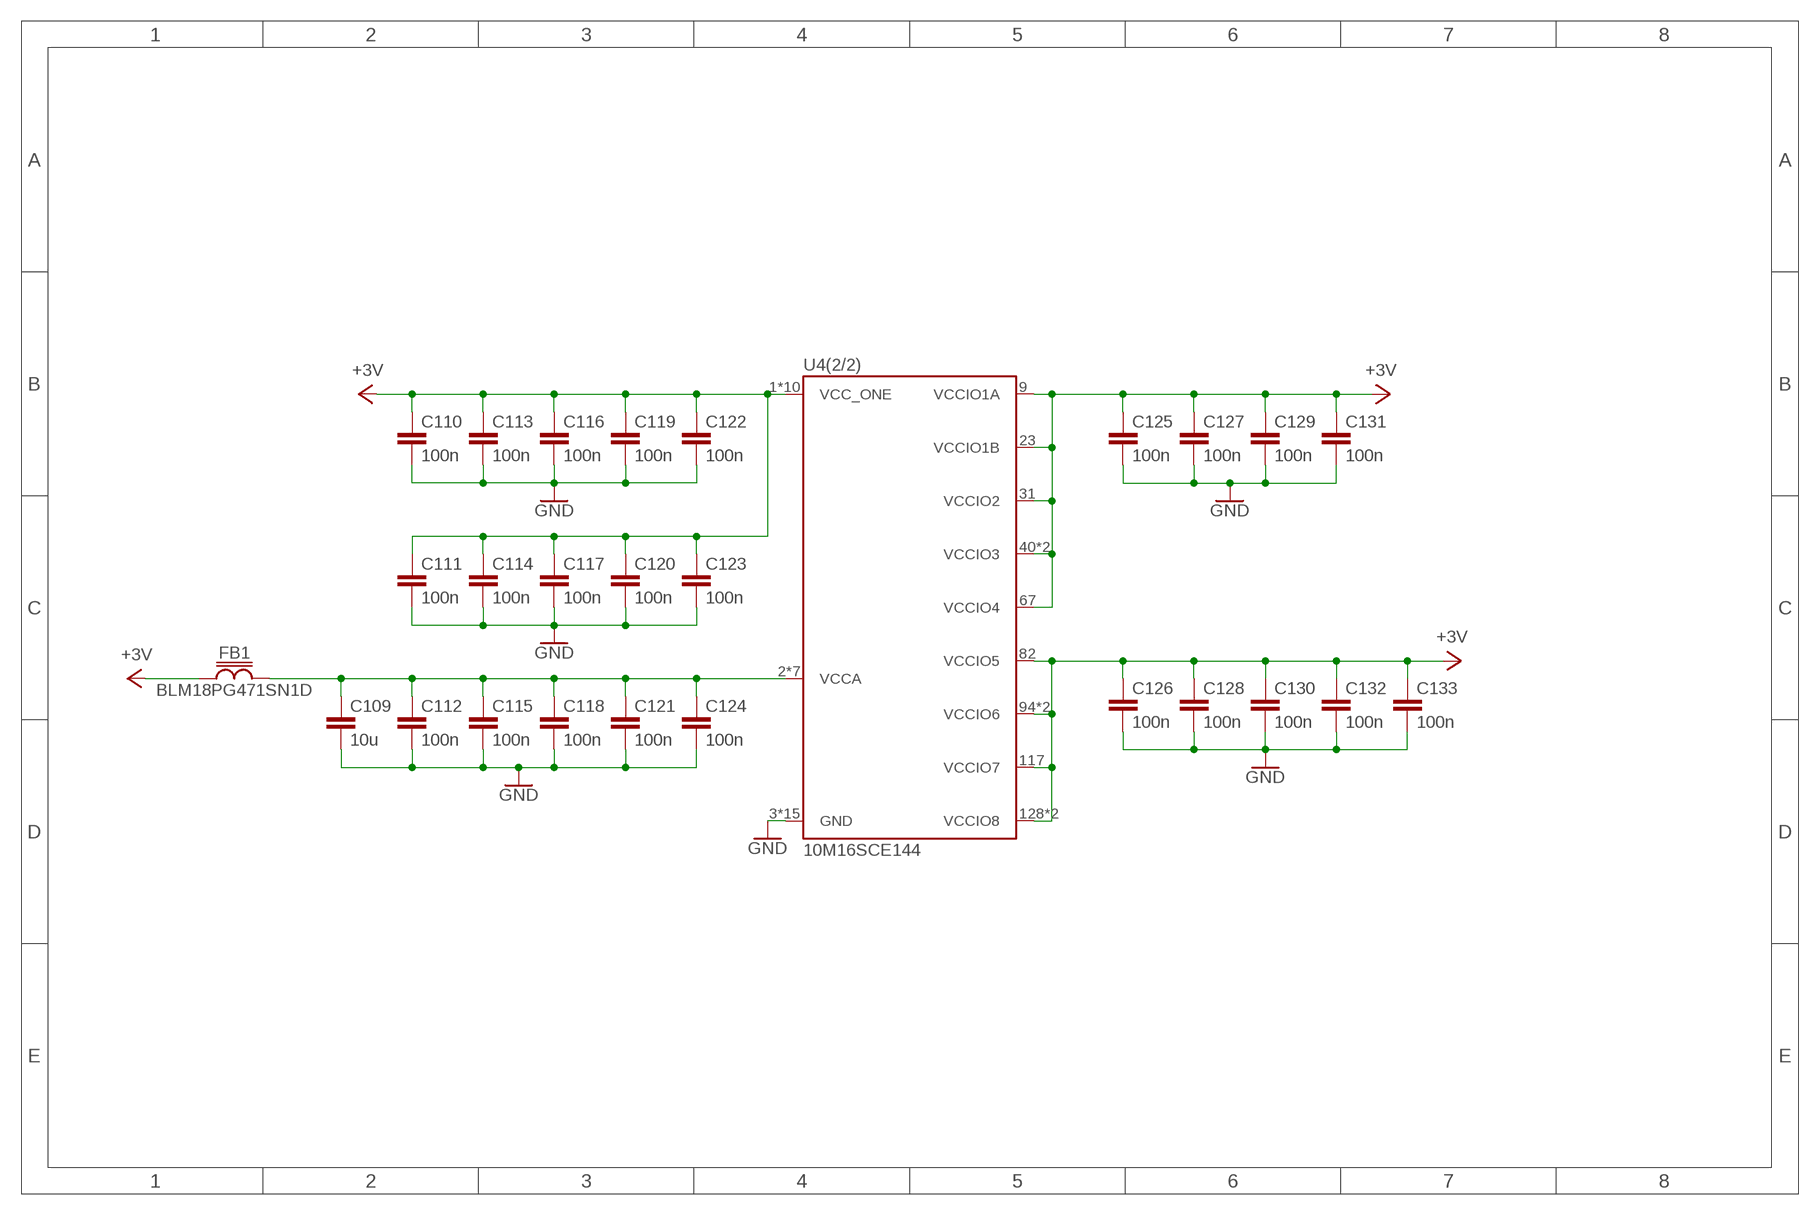
[diagram p13: schematic, sheet 14]

### Parts
C109  10u  C2012  [2012]
C110  100n  C1608  [1608]
C111  100n  C1608  [1608]
C112  100n  C1608  [1608]
C113  100n  C1608  [1608]
C114  100n  C1608  [1608]
C115  100n  C1608  [1608]
C116  100n  C1608  [1608]
C117  100n  C1608  [1608]
C118  100n  C1608  [1608]
C119  100n  C1608  [1608]
C120  100n  C1608  [1608]
C121  100n  C1608  [1608]
C122  100n  C1608  [1608]
C123  100n  C1608  [1608]
C124  100n  C1608  [1608]
C125  100n  C1608  [1608]
C126  100n  C1608  [1608]
C127  100n  C1608  [1608]
C128  100n  C1608  [1608]
C129  100n  C1608  [1608]
C130  100n  C1608  [1608]
C131  100n  C1608  [1608]
C132  100n  C1608  [1608]
C133  100n  C1608  [1608]
FB1  BLM18PG471SN1D  FB1608  [1608]

### Nets
+3V: C110.1 C111.1 C113.1 C114.1 C116.1 C117.1 C119.1 C120.1 C122.1 C123.1 C125.1 C126.1 C127.1 C128.1 C129.1 C130.1 C131.1 C132.1 C133.1 FB1.1 U4.1((2/2):VCC_ONE) U4.9((2/2):VCCIO1A) U4.23((2/2):VCCIO1B) U4.31((2/2):VCCIO2) U4.36((2/2):VCC_ONE) U4.37((2/2):VCC_ONE) U4.40((2/2):VCCIO3) U4.49((2/2):VCCIO3) U4.51((2/2):VCC_ONE) U4.67((2/2):VCCIO4) U4.72((2/2):VCC_ONE) U4.73((2/2):VCC_ONE) U4.82((2/2):VCCIO5) U4.94((2/2):VCCIO6) U4.103((2/2):VCCIO6) U4.108((2/2):VCC_ONE) U4.109((2/2):VCC_ONE) U4.115((2/2):VCC_ONE) U4.117((2/2):VCCIO7) U4.128((2/2):VCCIO8) U4.139((2/2):VCCIO8) U4.144((2/2):VCC_ONE) ; also sheet 1,2,4,5,6,7,8
GND: C109.2 C110.2 C111.2 C112.2 C113.2 C114.2 C115.2 C116.2 C117.2 C118.2 C119.2 C120.2 C121.2 C122.2 C123.2 C124.2 C125.2 C126.2 C127.2 C128.2 C129.2 C130.2 C131.2 C132.2 C133.2 U4.3((2/2):GND) U4.4((2/2):GND) U4.42((2/2):GND) U4.53((2/2):GND) U4.63((2/2):GND) U4.68((2/2):GND) U4.83((2/2):GND) U4.95((2/2):GND) U4.104((2/2):GND) U4.116((2/2):GND) U4.125((2/2):GND) U4.133((2/2):GND) U4.137((2/2):GND) U4.142((2/2):GND) U4.PAD((2/2):GND) ; also sheet 1,2,3,4,5,6,7,8,9,10,11,12,13
VCCA: C109.1 C112.1 C115.1 C118.1 C121.1 C124.1 FB1.2 U4.2((2/2):VCCA) U4.5((2/2):VCCA) U4.34((2/2):VCCA) U4.35((2/2):VCCA) U4.71((2/2):VCCA) U4.107((2/2):VCCA) U4.143((2/2):VCCA)

## Library data of the parts
BZ1 = kiks-mechanical:PKLCS1212E*
C1 C11-C13 C26 = kiks-passive:CPOL
C2-C10 C14-C25 C27-C133 = kiks-passive:C
CN1 = kiks-connector:5569-04A2
CN2 = kiks-connector:3557-*; COLOR: Yellow
CN3 CN12 CN14 CN16 CN18 = kiks-connector:43045-0800
CN4 CN5 = kiks-connector:PIN1X2
CN6 CN7 = kiks-connector:SOCKET1X10
CN8 = kiks-connector:PIN2X3
CN9 CN10 = kiks-connector:ALTERA-JTAG
CN11 CN13 CN15 CN17 CN19 = kiks-connector:53426-0410
CN20 = kiks-connector:PIN1X8
D1 D9 D10 = kiks-discrete:ZENER-?
D2-D5 D7 D8 = kiks-discrete:SBD-?
D6 D12 D13 = kiks-discrete:LED
D11 D14-D22 = kiks-discrete:DIODE-?
F1-F6 = kiks-passive:RF
FB1 = kiks-passive:FB
J1 = kiks-connector:JUMPER1X3
J2 = kiks-connector:JUMPER2X5
L1-L7 = kiks-passive:L-?
Q1 Q3-Q5 Q8-Q12 = kiks-discrete:MOS-N-?
Q2 Q6 = kiks-discrete:NPN-
Q7 = kiks-discrete:MOS-P-?
R1-R4 R6-R33 R36 R39-R41 R43-R55 R60-R67 R69-R78 R80-R89 R91-R100 R102-R105 = kiks-passive:R
R5 = kiks-passive:WSLF2512
R34 R35 R37 R38 R42 R56-R59 R68 R79 R90 R101 R106 = kiks-passive:R4A
SW1 = kiks-mechanical:B-12JV
SW2 SW3 = kiks-mechanical:EVQ-PU?02K
TP1-TP19 = kiks-mechanical:TESTPAD
U1 = kiks-ic:INA219
U2 = kiks-ic:LT3504
U3 = kiks-ic:LTC3862?*
U4 = kiks-ic:10M16SCE144
U5 = kiks-ic:QPIFLASH
U6 = kiks-ic:PCAL6416A
U7 = kiks-ic:EEPROM-I2C-WP
U8 = kiks-ic:ICM-20689
U9 = kiks-ic:ADS7223
U10 = kiks-ic:SPX3819M5-L-*
U11 U12 = kiks-ic:74165-?
U13 U16 U19 U22 = kiks-ic:DRV8332
U14 U15 U17 U18 U20 U21 U23 U24 = kiks-ic:INA240A*?; GAIN: 50
U25 = kiks-ic:DRV8312
X1 = kiks-ic:ASDM